# Altium project Electric Car Project.PrjPcb (part 1 of 2)
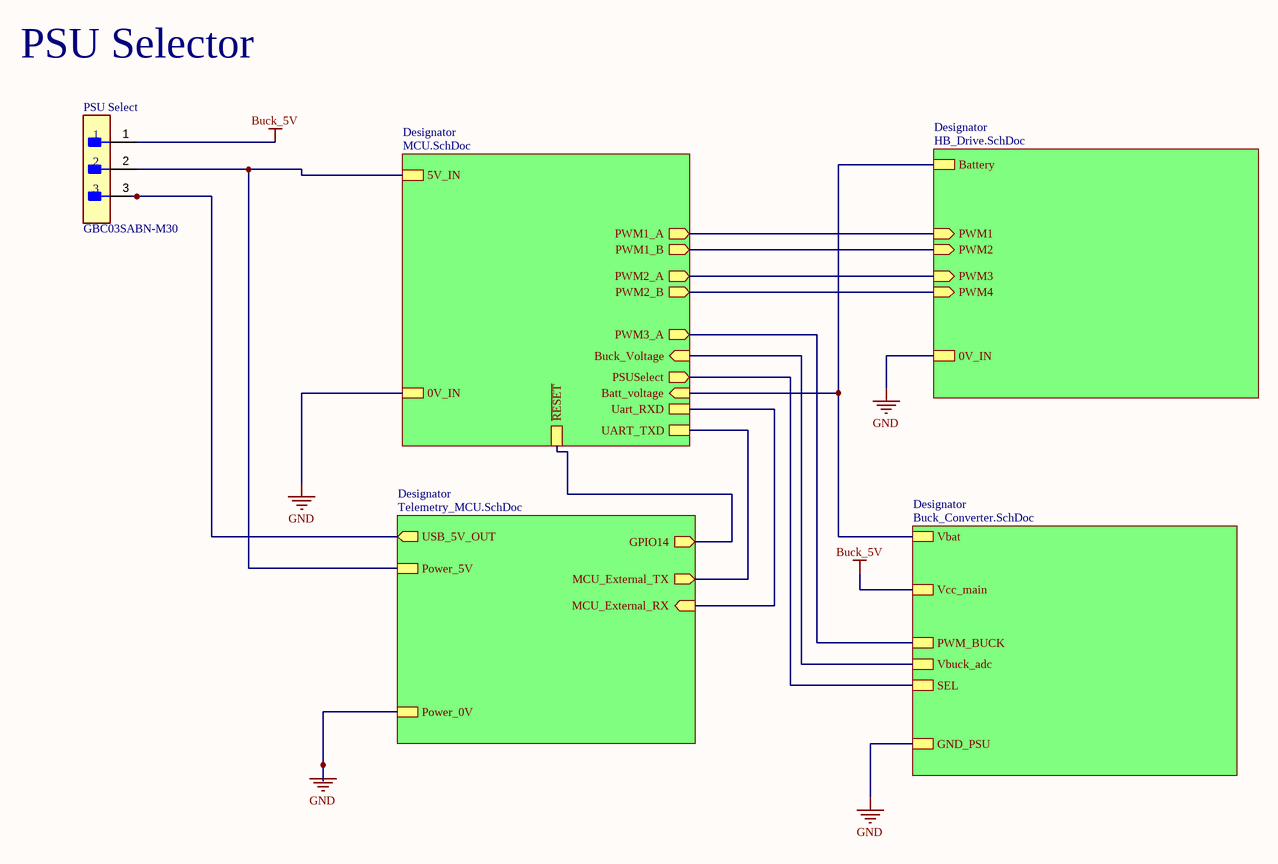
[diagram p0: Top_Level.SchDoc]
5 sheets, 126 parts. Net scope: strictly hierarchical (ports join the sheet entries above them; power ports are local).
Board file: PCB1.PcbDoc
Sheets:
  Top_Level.SchDoc
    Designator = MCU.SchDoc
    Designator = Telemetry_MCU.SchDoc
    Designator = Buck_Converter.SchDoc
    Designator = HB_Drive.SchDoc

## Sheet Top_Level.SchDoc
size 420 x 297 mm; SheetNumber: 1; SheetTotal: 5

### Parts
PSU_Select  GBC03SABN-M30  [FP-GBC03SABN-M30-MFG]

### Sub-sheets
Designator = MCU.SchDoc: PWM1_B (out), 0V_IN, PWM1_A (out), PSUSelect (out), PWM3_A (out), UART_TXD, Uart_RXD, Buck_Voltage (in), 5V_IN, PWM2_A (out), PWM2_B (out), Batt_voltage (in), ~{RESET}
Designator = Telemetry_MCU.SchDoc: Power_5V, MCU_External_TX (out), Power_0V, MCU_External_RX (in), USB_5V_OUT (out), GPIO14 (out)
Designator = Buck_Converter.SchDoc: SEL, Vbat, PWM_BUCK, Vcc_main, GND_PSU, Vbuck_adc
Designator = HB_Drive.SchDoc: PWM3 (in), PWM2 (in), PWM1 (in), PWM4 (in), 0V_IN, Battery

### Nets
+5: PSU_Select.2 ; sheet Designator/5V_IN, sheet Designator/Power_5V
+5_USB: PSU_Select.3 ; sheet Designator/USB_5V_OUT
BAT_VOLTAGE: sheet Designator/Batt_voltage, sheet Designator/Vbat, sheet Designator/Battery
Buck_5V: PSU_Select.1 ; sheet Designator/Vcc_main
GND: sheet Designator/0V_IN, sheet Designator/Power_0V, sheet Designator/GND_PSU, sheet Designator/0V_IN
BUCK_ADC: sheet Designator/Buck_Voltage, sheet Designator/Vbuck_adc
CS_PWM1B: sheet Designator/PWM1_B, sheet Designator/PWM2
MOSI_PWM_2A: sheet Designator/PWM3_A, sheet Designator/PWM_BUCK
PSU_SELECT: sheet Designator/PSUSelect, sheet Designator/SEL
PWM_1A: sheet Designator/PWM1_A, sheet Designator/PWM1
PWM_2A: sheet Designator/PWM2_A, sheet Designator/PWM3
PWM_2B: sheet Designator/PWM2_B, sheet Designator/PWM4
RESET: sheet Designator/~{RESET}, sheet Designator/GPIO14
RXD: sheet Designator/Uart_RXD, sheet Designator/MCU_External_RX
TXD: sheet Designator/UART_TXD, sheet Designator/MCU_External_TX

### Notes on the sheet
- PSU Selector
- THIS DOCUMENT AND THE DATA DISCLOSED HEREIN OR
- HEREWITH IS THE PROPERTY OF ALTIUM LIMITED AND MAY
- DWG NO:
- REVISION
- REV:
- DESCRIPTION
- DATE
- APPROVED
- BE FREELY DISTRIBUTED IN WHOLE. NO RIGHTS ARE
- RESERVED OR EXPRESS OR IMPLIED WARANTEE GIVEN.
- ENG:
- APPROVALS
- PROJECT
- DSN:
- CHK:
- REFERENCE DOCUMENTS
- PROJECT REVISION:
- TITLE
- DOCUMENT REVISION:
- DESIGN ITEM:
- BOM:
- FAB DWG:
- PCB DWG:
- ASSY DWG:
- SCALE:
- A3
- SIZE
- CAGE CODE
- FILE NAME
- DWG NO.
- SHEET
- OF
- REV

### Library data of the parts
PSU_Select = CMP-25680-000055-1: CONN HEADER SMD 3POS 2.54MM; Number of Positions: 3; Gender: Male; Connector Type: Male Pin; Pitch: 0.1inch; Contact Type: Male Pin; Contact Mating Length: 0.23inch; Termination: Solder; Housing Material: Plastic; Width: 2.54mm; Package Quantity: 1; Lead Free: Lead Free; Color: Black; Contact Plating: Gold; Housing Color: Black; Mount: Surface Mount; RoHS Compliant: Yes; Length: 7.62mm; Height: 2.54mm; Number of Contacts: 3; Contact Material: Bronze; Series: -; Number of Rows: 1; Packaging: Bulk

## Sheet MCU.SchDoc
size 420 x 297 mm; SheetNumber: 3; SheetTotal: 5
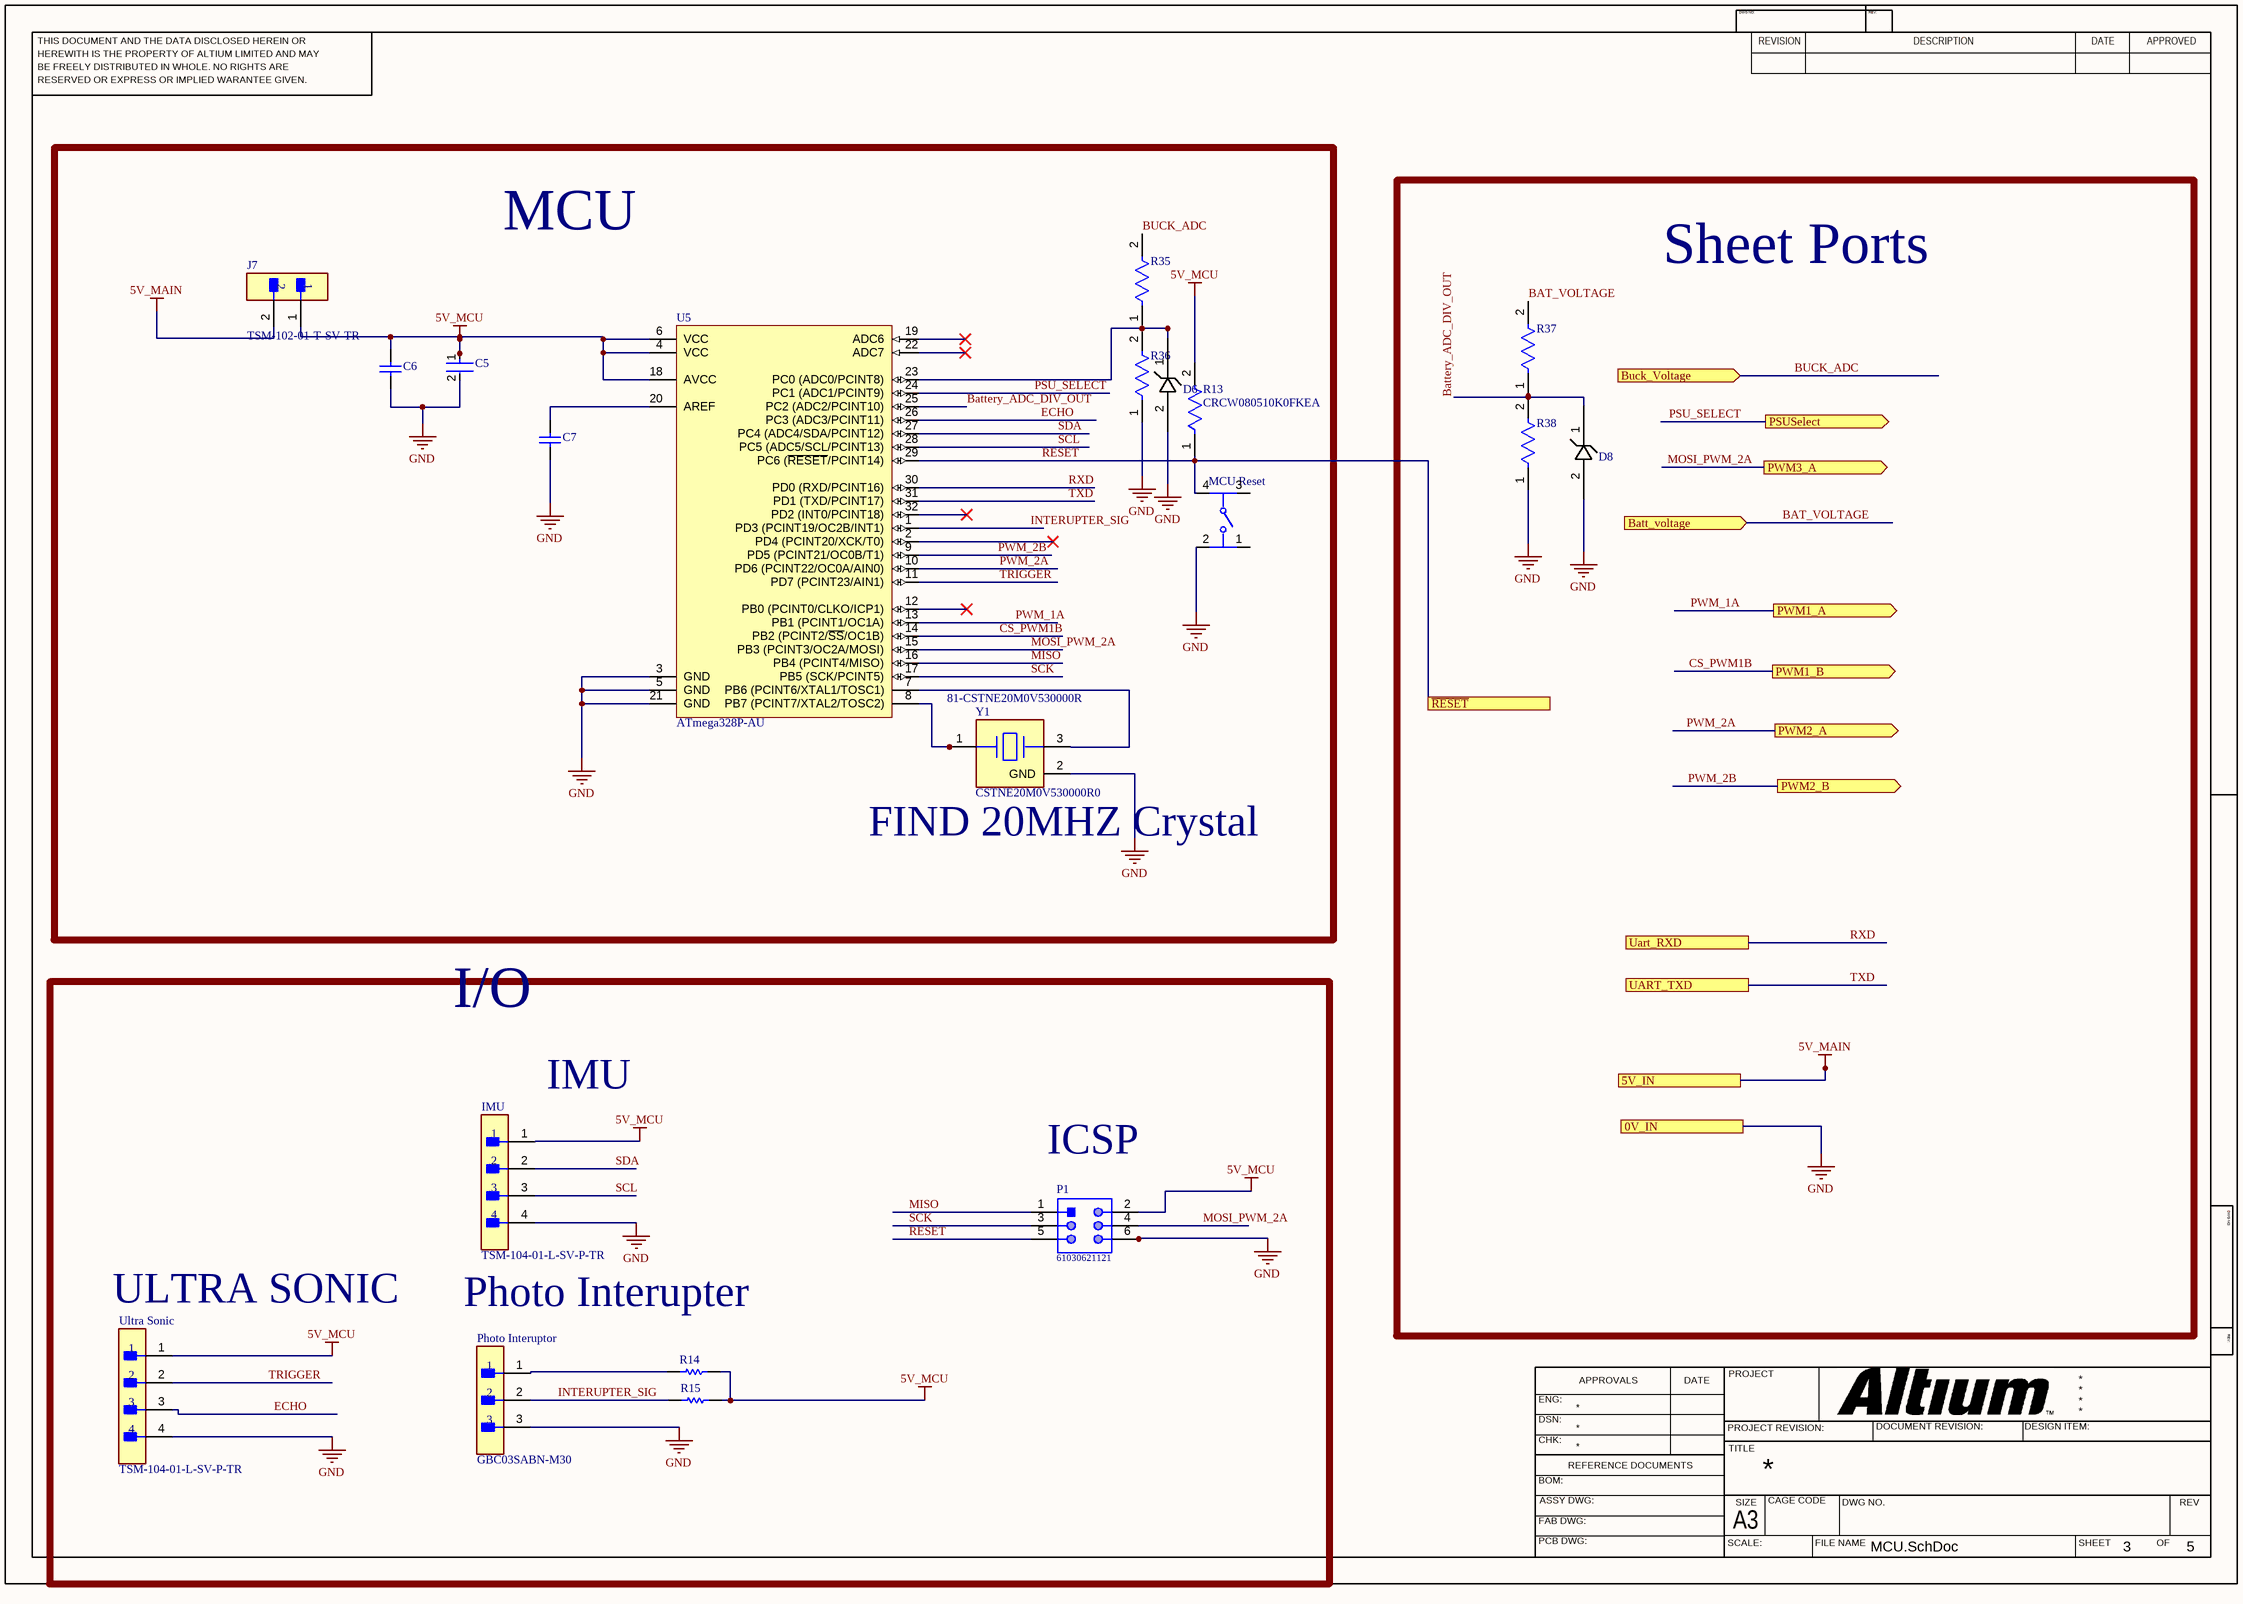
[diagram p1: MCU.SchDoc]

### Parts
C5  C0805C106K8PACTU  [FP-C0805C-DG-MFG]  (value not drawn)
C6  GRM21BR71H104KA01L  [CAPC2013X135X45ML10T25]  (value not drawn)
C7  GRM21BR71H104KA01L  [CAPC2013X135X45ML10T25]  (value not drawn)
D6  BZT52-C5V1_R1_00001  [BZT52-C5V1_R1_00001]  (value not drawn)
D8  BZT52-C5V1_R1_00001  [BZT52-C5V1_R1_00001]  (value not drawn)
IMU  TSM-104-01-L-SV-P-TR  [FP-TSM-104-01-L-SV-P-TR-MFG]
J7  TSM-102-01-T-SV-TR  [FP-TSM-102-01-T-SV-TR-MFG]
MCU_Reset  PTS645SM43SMTR92LFS  [FP-PTS645SM43SMTR92LFS-MFG]  (value not drawn)
P1  61030621121  [61030621121]
Photo_Interuptor  GBC03SABN-M30  [FP-GBC03SABN-M30-MFG]
R13  CRCW080510K0FKEA  [FP-CRCW0805-e3-MFG]
R14  ERA6AEB181V  [RESC2013X60X40LL20T25]  (value not drawn)
R15  SG73S2ATTD2201F  [RESC2013X60X30ML20T20]  (value not drawn)
R35  CRCW080510K0FKEA  [FP-CRCW0805-e3-IPC_A]  (value not drawn)
R36  CRCW080510K0FKEA  [FP-CRCW0805-e3-IPC_A]  (value not drawn)
R37  CRCW080510K0FKEA  [FP-CRCW0805-e3-IPC_A]  (value not drawn)
R38  CRCW080510K0FKEA  [FP-CRCW0805-e3-IPC_A]  (value not drawn)
U5  ATmega328P-AU  [32A_M]
Ultra_Sonic  TSM-104-01-L-SV-P-TR  [FP-TSM-104-01-L-SV-P-TR-MFG]
Y1  CSTNE20M0V530000R0  Supplier Part Number 1: 81-CSTNE20M0V530000R  [FP-CSTNE16M0V530000R0-MFG]

### Blocks framed on the sheet
MCU: C5-C7 D6 J7 MCU_Reset R13 R35 R36 U5 Y1
Sheet Ports: D8 R37 R38
I/O: IMU P1 Photo_Interuptor R14 R15 Ultra_Sonic

### Ports
0V_IN, 5V_IN, Batt_voltage (in), Buck_Voltage (in), PSUSelect (out), PWM1_A (out), PWM1_B (out), PWM2_A (out), PWM2_B (out), PWM3_A (out), Uart_RXD, UART_TXD, ~{RESET}

### Nets
5V_MAIN: J7.2 ; port 5V_IN  [project net +5]
5V_MCU: C5.1 C6.1 IMU.1 J7.1 P1.2 R13.2 R14.2 R15.2 U5.4(VCC) U5.6(VCC) U5.18(AVCC) Ultra_Sonic.1
BAT_VOLTAGE: R37.2 ; port Batt_voltage
GND: C5.2 C6.2 C7.2 D6.2 D8.2 IMU.4 MCU_Reset.2 P1.6 Photo_Interuptor.3 R36.1 R38.1 U5.3(GND) U5.5(GND) U5.21(GND) Ultra_Sonic.4 Y1.2(GND) ; port 0V_IN
Battery_ADC_DIV_OUT: D8.1 R37.1 R38.2 U5.25(PC2_(ADC2/PCINT10))
BUCK_ADC: R35.2 ; port Buck_Voltage
CS_PWM1B: U5.14(PB2_(PCINT2/~{SS}/OC1B)) ; port PWM1_B
ECHO: U5.26(PC3_(ADC3/PCINT11)) Ultra_Sonic.3
INTERUPTER_SIG: Photo_Interuptor.2 R15.1 U5.1(PD3_(PCINT19/OC2B/INT1))
MISO: P1.1 U5.16(PB4_(PCINT4/MISO))
MOSI_PWM_2A: P1.4 U5.15(PB3_(PCINT3/OC2A/MOSI)) ; port PWM3_A
PSU_SELECT: U5.24(PC1_(ADC1/PCINT9)) ; port PSUSelect
PWM_1A: U5.13(PB1_(PCINT1/OC1A)) ; port PWM1_A
PWM_2A: U5.10(PD6_(PCINT22/OC0A/AIN0)) ; port PWM2_A
PWM_2B: U5.9(PD5_(PCINT21/OC0B/T1)) ; port PWM2_B
RESET: MCU_Reset.4 P1.5 R13.1 U5.29(PC6_(~{RESET}/PCINT14)) ; port ~{RESET}
RXD: U5.30(PD0_(RXD/PCINT16)) ; port Uart_RXD
SCK: P1.3 U5.17(PB5_(SCK/PCINT5))
SCL: IMU.3 U5.28(PC5_(ADC5/SCL/PCINT13))
SDA: IMU.2 U5.27(PC4_(ADC4/SDA/PCINT12))
TRIGGER: U5.11(PD7_(PCINT23/AIN1)) Ultra_Sonic.2
TXD: U5.31(PD1_(TXD/PCINT17)) ; port UART_TXD
NetC7_1: C7.1 U5.20(AREF)
NetD6_1: D6.1 R35.1 R36.2 U5.23(PC0_(ADC0/PCINT8))
NetPhoto_Interuptor_1: Photo_Interuptor.1 R14.1
NetU5_7: U5.7(PB6_(PCINT6/XTAL1/TOSC1)) Y1.3(Output)
NetU5_8: U5.8(PB7_(PCINT7/XTAL2/TOSC2)) Y1.1(Input)

Not connected (* = marked no-connect by the designer): MCU_Reset 1 3; U5 2(PD4_(PCINT20/XCK/T0))* 12(PB0_(PCINT0/CLKO/ICP1))* 19(ADC6)* 22(ADC7)* 32(PD2_(INT0/PCINT18))*

### Notes on the sheet
- (near Y1) FIND 20MHZ Crystal
- IMU
- (near P1) ICSP
- (near Ultra_Sonic) ULTRA SONIC
- Photo Interupter
- THIS DOCUMENT AND THE DATA DISCLOSED HEREIN OR
- HEREWITH IS THE PROPERTY OF ALTIUM LIMITED AND MAY
- DWG NO:
- REVISION
- REV:
- DESCRIPTION
- DATE
- APPROVED
- BE FREELY DISTRIBUTED IN WHOLE. NO RIGHTS ARE
- RESERVED OR EXPRESS OR IMPLIED WARANTEE GIVEN.
- ENG:
- APPROVALS
- PROJECT
- DSN:
- CHK:
- REFERENCE DOCUMENTS
- PROJECT REVISION:
- TITLE
- DOCUMENT REVISION:
- DESIGN ITEM:
- BOM:
- FAB DWG:
- PCB DWG:
- ASSY DWG:
- SCALE:
- A3
- SIZE
- CAGE CODE
- FILE NAME
- DWG NO.
- SHEET
- OF
- REV

### Library data of the parts
C5 = CMP-2007-03243-2: CAP CER 10UF 10V X5R 0805; Manufacturer: Kemet; 3DS Part Number: 220-00001; Tolerance: 10%; Temperature Coefficient: 15%; Material: Ceramic; Device Class L2: Capacitors; Device Class L1: Passive Components; ComponentLink2URL: https://content.kemet.com/datasheets/KEM_C1006_X5R_SMD.pdf; Height: 1.4mm; Lead Free: Yes; Manufacturer Part Number: C0805C106K8PACTU; Digikey Description: CAP CER 10UF 10V X5R 0805; Octopart: https://octopart.com/c0805c106k8pactu-kemet-98697; Capacitance: 10uF; Value: 10uF; Temperature Range Low: -55°C; Temperature: -55°C to +85°C; Automotive: No; Mouser Description: CAP CER 10UF 10V X5R 0805; Ipc Land Pattern Name: CAPC200125X125; Temperature Range High: +85°C; Voltage: 10V; RoHS: TRUE; Device Class L3: Ceramic Capacitors; ComponentLink2Description: Datasheet; Voltage Rating: 10V; Package: C0805C-DG; Temperature Characteristic: X5R; Category: Cap
C6 C7 = CMP-2100-03644-1: Chip Capacitor, 0.1 uF, +/- 10%, 50 V, -55 to 125 degC, 0805 (2012 Metric), RoHS, Tape and Reel; Manufacturer: Murata; Voltage: 50V; Capacitance: 100nF; Insulation Resistance: 10GR; Dielectric Material: Ceramic; Dielectric: X7R; Package Description: 2-Pin Surface Mount Device, Body 2 x 1.25 mm; Manufacturer URL: http://www.murata.com/; Case Code (Imperial): 0805; Datasheet URL: http://psearch.en.murata.com/capacitor/product/GRM21BR71H104KA01%23.pdf; Termination: SMD/SMT; Lead Free: LeadFree; Package Quantity: 1; Mount: SurfaceMount; REACH SVHC: Unknown; Thickness: 0.053inch; Height: 1.25mm; Case/Package: 0805; Voltage Rating: 50V; Width: 0.049inch; Case Code (Metric): 2012; Material: Ceramic; Min Operating Temperature: -55degC; RoHSCompliant: true; Datasheet Version: 42675.0; Voltage Rating (DC): 50V; Tolerance: 10%; Package Reference: 0805; Depth: 1.25mm; Length: 2mm; Max Operating Temperature: 125degC; Packaging: TapeandReel; Number of Pins: 2; Radiation Hardening: No
D6 D8 = BZT52-C5V1_R1_00001: BZT52-C5V1_R1_00001 / 5.1V Zener Diode
IMU Ultra_Sonic = CMP-02766-000011-1: CONN HEADER SMD 4POS 2.54MM; Manufacturer: Samtec; Number Of Contacts: 4; Conn Gender: Male; Standoff Height: 0.04inch; Conn Orientation: Vertical; Current Rating: 5.4A; Voltage Rating: 475V; Manufacturer Part Number: TSM-104-01-L-SV-P-TR; Contact Material: Gold,Nickel; RoHS: TRUE; ComponentLink2URL: http://suddendocs.samtec.com/prints/tsm-1xx-xx-xxx-sv-xx-xxx-xx-mkt.pdf; Package: TSM-104-01-L-SV-P-TR; Lead Free: Yes; Automotive: No; Category: Conn; Digikey Description: CONN HEADER SMD 4POS 2.54MM; ComponentLink2Description: Datasheet; Temperature: -55°C to +125°C; Height: 0.403inch; Device Class L1: Connectors; Device Class L3: unset; Octopart: https://octopart.com/tsm-104-01-l-sv-p-tr-samtec-6805355; Pitch: 2.54mm; Footprint Url: http://suddendocs.samtec.com/prints/tsm-1xx-xx-xx-sv-xx-xxx-xx-footprint.pdf; Device Class L2: Headers and Wire Housings; Temperature Range Low: -55°C; Number Of Rows: 1; Temperature Range High: +125°C
J7 = CMP-02766-000113-1: CONN HEADER SMD 2POS 2.54MM; Gender: Male; Max Voltage Rating (AC): 475V; Number of Contacts: 2; Max Current Rating: 7A; Contact Material: Bronze; Min Operating Temperature: -55°C; REACH SVHC: No SVHC; Housing Material: Polymer; Lead Free: Lead Free; Orientation: Straight; Radiation Hardening: No; Number of Rows: 1; Length: 5.08mm; Housing Color: Black; Max Operating Temperature: 105°C; Contact Plating: Tin; Depth: 2.54mm; Packaging: Tape and Reel; Pitch: 2.54mm; Termination: Solder
MCU_Reset = CMP-2000-05160-2: SWITCH TACTILE SPST-NO 0.05A 12V; Contact Resistance: 100mR; Throw Configuration: SPST; Illumination Type: Non-Illuminated; Mechanical Life: 100000Cycles; Current Rating: 50mA; Switch Function: Off-Mom; Actuator Length: 0.85mm; Actuator Material: Nylon; Actuator Type: Standard; Operating Force: 160gf; Min Operating Temperature: -20°C; REACH SVHC: No SVHC; Termination: Gull Wing; Case/Package: SMD/SMT; Packaging: Tape and Reel; Mount: Surface Mount; Voltage Rating (DC): 12V; Orientation: Straight; Lead Free: Lead Free; Contact Material: Silver; Color: Black; Max Current Rating: 50mA; Contact Plating: Silver; Depth: 9mm; Package Quantity: 1; Max Voltage Rating (DC): 12V; Length: 6mm; Max Operating Temperature: 60°C
P1 = CMP-1502-01051-1: SMT Vertical Pin Header WR-PHD, Pitch 2.54 mm, Dual Row, 6 pins; Manufacturer: Wurth Elektronik; Gender: Male; Withstanding Voltage: 500VAC; Contact Resistance: 20mOhm; Pitch: 2.54mm; Working Voltage: 250VAC; Rated Current: 3A; Pin Number: 6; Part Number: 61030621121; Row Number: Dual; Operating Temperature: -40to125degC; Packaging: TapeandReel; Manufacturer URL: http://www.we-online.de; Package Reference: 61030621121; Publisher: WurthElektronik; Orientation: Vertical; Mounting Technology: SMT; Datasheet URL: https://katalog.we-online.de/em/datasheet/6103xx21121.pdf
Photo_Interuptor = CMP-25680-000055-1: as PSU_Select on sheet Top_Level; Contact Type: Male Pin; Contact Mating Length: 0.23inch; Termination: Solder; Housing Material: Plastic; Width: 2.54mm; Package Quantity: 1; Lead Free: Lead Free; Color: Black; Contact Plating: Gold; Housing Color: Black; Mount: Surface Mount; RoHS Compliant: Yes; Length: 7.62mm; Height: 2.54mm; Number of Contacts: 3; Contact Material: Bronze; Series: -; Number of Rows: 1; Packaging: Bulk
R13 R35-R38 = CMP-2001-04908-2: RES Thick Film, 10kΩ, 1%, 0.125W, 100ppm/°C, 0805; Resistance: 10kR; Voltage Rating (DC): 150V; Power Rating: 125mW; Weight: 0.000194oz; Package Quantity: 5000; Military Standard: Not; Max Operating Temperature: 155°C; Temperature Coefficient: 100ppm/°C; Contact Plating: Tin; Width: 1.25mm; Height: 0.45mm; Radiation Hardening: No; Tolerance: 1%; Min Operating Temperature: -55°C; Voltage Rating: 150V; Length: 2mm; Depth: 1.25mm; Termination: SMD/SMT; Packaging: Tape and Reel; Case/Package: 0805; Case Code (Metric): 2012; Lead Free: Lead Free; Case Code (Imperial): 0805; Composition: Thick Film
R14 = CMP-2001-00604-1: Manufacturer: Panasonic; Part Number: ERA6AEB181V
R15 = CMP-2001-02579-1: Manufacturer: KOA Speer; Part Number: SG73S2ATTD2201F
U5 = CMP-0095-00269-2: 8-bit AVR Microcontroller, 32KB Flash, 1KB EEPROM, 2KB SRAM, 32-pin TQFP, Industrial Grade (-40°C to 85°C); PackageDescription: 32-Lead, 7x7x1.0 mm Body, 0.8mm Lead Pitch, Thin Profile Plastic Quad Flat Package (TQFP); DatasheetVersion: revD, May-2011; RevisionNote: DatasheetVersion & PackageVersion updated. URLs added.; ComponentLink1URL: http://www.atmel.com/; ComponentLink2Description: ATmega48A/48PA/88A/88PA/168A/168PA/328/328P Datasheet; Code_JEDEC: MS-026-ABA; ComponentLink1Description: Manufacturer URL; PackageReference: 32A; ComponentLink3Description: ATmega48A/48PA/88A/88PA/168A/168PA/328/328P Summary; ComponentLink2URL: http://www.atmel.com/dyn/resources/prod_documents/doc8271.pdf; PackageVersion: revC, Oct-2010; ComponentLink3URL: http://www.atmel.com/dyn/resources/prod_documents/8271S.pdf
Y1 = CMP-06054-000001-1: CERAMIC RES 20.0000MHZ 15PF SMD; Manufacturer Part Number: CSTNE16M0V530000R0; Manufacturer: Murata; Tolerance: 0.5%; Stability: 0.3%; Frequency: 16MHz; Esr: 40Ω; Isolated Power: No; Number of Channels: 6; Channel Type: Unidirectional; Data Rate: 150Mbps; Propagation Delay: 13ns; Pulse Width Distortion (PWD): 4.5ns; Impedance: 40R; Lead Free: Yes; ComponentLink2URL: https://www.murata.com/en-sg/products/productdata/8801162231838/SPEC-CSTNE16M0V530000R0.pdf?1545967809000; ComponentLink2Description: Datasheet; Device Class L3: Crystals; Load Capacitance: 15pF; Temperature: -40°C to +85°C; Temperature Range High: +85°C; Series: CSTNE_V; Mouser Description: Ceramic Resonator 16MHz ±0.5% (Tol) ±0.3% (Stability) 15pF 40Ohm 3-Pin CSMD T/R; Automotive: No; RoHS: TRUE; Device Class L2: Crystals / Oscillators; Package: 0; Category: Crys; Device Class L1: Passive Components; Height: 1mm; Temperature Range Low: -40°C; Digikey Description: CERAMIC RES 16.0000MHZ 15PF SMD; Octopart: https://octopart.com/cstne16m0v530000r0-murata-91406924; Supplier 1: Mouser; Stock 1: 22987; Pricing 1: 1=0.27000, 10=0.22300, 50=0.20100, 100=0.17800, 1000=0.14300, 10000=0.13400 (USD); Mount: Surface Mount; Case/Package: SSOP; Min Operating Temperature: -40°C; Max Operating Temperature: 85°C; Type: General Purpose; Resistor Type: Ceramic; Packaging: Rail/Tube; Frequency Stability: 0.3%; Frequency Tolerance: 0.5%; Capacitance: 15pF; RoHS Compliant: Yes; ComponentLink1URL: https://www.murata.com/en/products/productdata/8801161510942/SPEC-CSTNE20M0V530000R0.pdf?src-supplier=Digi-Key; ComponentLink1Description: https://www.murata.com/en/products/productdata/8801161510942/SPEC-CSTNE20M0V530000R0.pdf?src-supplier=Digi-Key

## Sheet Telemetry_MCU.SchDoc
size 420 x 297 mm; SheetNumber: 4; SheetTotal: 5
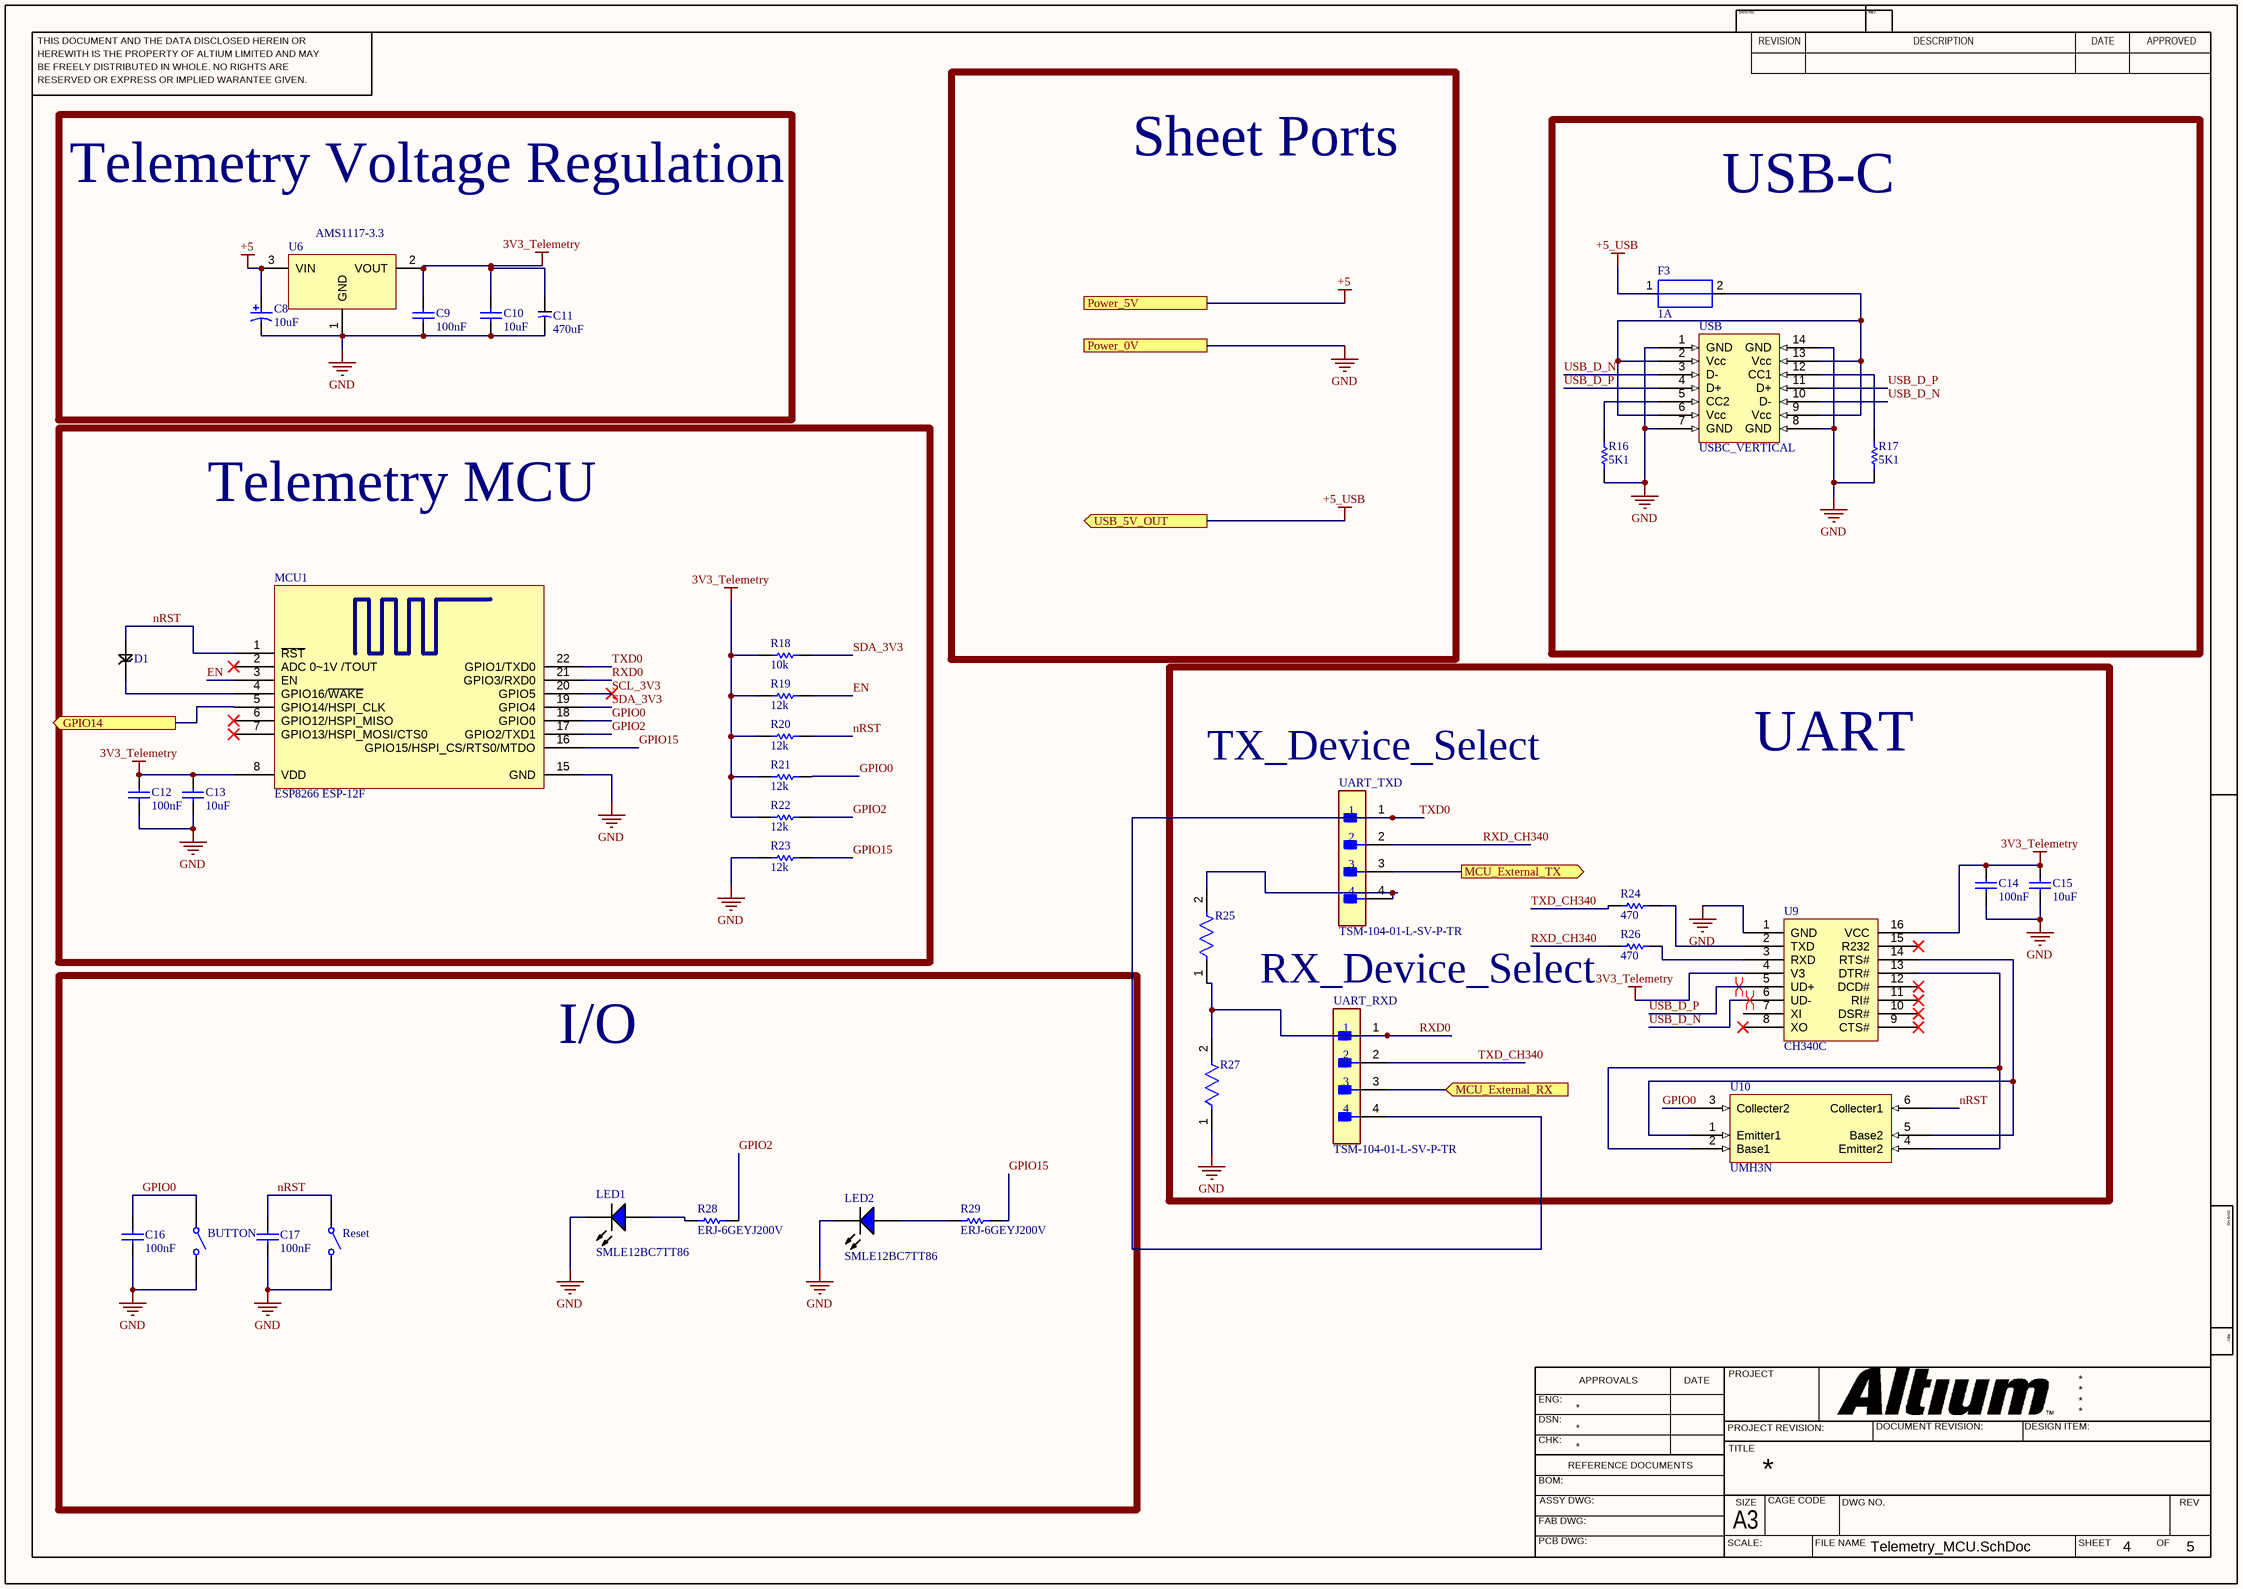
[diagram p2: Telemetry_MCU.SchDoc]

### Parts
BUTTON  434111050826  [434111050826]  (value not drawn)
C8  10uF  [KEMT-A-3216-18-2_M]
C9  100nF  [CAPC2013X88X50NL20T25]
C10  10uF  [CAPC2013X140X50NL20T25]
C11  470uF  [ULR477M1AE85RR]
C12  100nF  [CAPC2013X88X50NL20T25]
C13  10uF  [CAPC2013X140X50NL20T25]
C14  100nF  [CAPC2013X88X50NL20T25]
C15  10uF  [CAPC2013X140X50NL20T25]
C16  100nF  [CAPC2013X88X50NL20T25]
C17  100nF  [CAPC2013X88X50NL20T25]
D1  DFLS230L-7  [DFLS230L-7]  (value not drawn)
F3  1A  [0ZCG0050AF2C]
LED1  SMLE12BC7TT86  [ROHM-SMLE12BC7TT86_V]
LED2  SMLE12BC7TT86  [ROHM-SMLE12BC7TT86_V]
MCU1  ESP8266 ESP-12F  [ESP8266 ESP_12F - Danon NoSPI]
R16  5K1  [RESC2013X50X30NL20T20]
R17  5K1  [RESC2013X50X30NL20T20]
R18  10k  [RESC2013X60X40NL20T25_A]
R19  12k  [RESC2013X60X40NL20T25_A]
R20  12k  [RESC2013X60X40NL20T25_A]
R21  12k  [RESC2013X60X40NL20T25_A]
R22  12k  [RESC2013X60X40NL20T25_A]
R23  12k  [RESC2013X60X40NL20T25_A]
R24  470  [RESC2013X50X30NL20T20]
R25  CRCW080510K0FKEA  [FP-CRCW0805-e3-IPC_A]  (value not drawn)
R26  470  [RESC2013X50X30NL20T20]
R27  CRCW080510K0FKEA  [FP-CRCW0805-e3-IPC_A]  (value not drawn)
R28  ERJ-6GEYJ200V  [RESC2013X70X40LL20T20]
R29  ERJ-6GEYJ200V  [RESC2013X70X40LL20T20]
Reset  434111050826  [434111050826]  (value not drawn)
U6  AMS1117-3.3  [SOT-223]
U9  CH340C  [SOP16_50Mil_PinPitch]
U10  UMH3N  [UMH3N]
UART_RXD  TSM-104-01-L-SV-P-TR  [FP-TSM-104-01-L-SV-P-TR-MFG]
UART_TXD  TSM-104-01-L-SV-P-TR  [FP-TSM-104-01-L-SV-P-TR-MFG]
USB  USBC_VERTICAL  [USBC_Vertical]

### Blocks framed on the sheet
Telemetry Voltage Regulation: C8-C11 U6
USB-C: F3 R16 R17 USB
Telemetry MCU: C12 C13 D1 MCU1 R18-R23
UART: C14 C15 R24-R27 U9 U10 UART_RXD UART_TXD
I/O: BUTTON C16 C17 LED1 LED2 R28 R29 Reset

### Ports
GPIO14 (out), MCU_External_RX (in), MCU_External_TX (out), Power_0V, Power_5V, USB_5V_OUT (out)

### Nets
3V3_Telemetry: C9.2 C10.2 C11.2 C12.2 C13.2 C14.2 C15.2 MCU1.8(VDD) R18.1 R19.1 R20.1 R21.1 R22.1 U6.2(VOUT) U9.4(V3) U9.16(VCC)
+5: C8.1 U6.3(VIN) ; port Power_5V
+5_USB: F3.1(+) ; port USB_5V_OUT
GND: BUTTON.2 C8.2 C9.1 C10.1 C11.1 C12.1 C13.1 C14.1 C15.1 C16.1 C17.1 LED1.2(K) LED2.2(K) MCU1.15(GND) R16.1 R17.1 R23.1 R27.1 Reset.2 U6.1(GND) U9.1(GND) USB.1(GND) USB.7(GND) USB.8(GND) USB.14(GND) ; port Power_0V
EN: MCU1.3(EN) R19.2
GPIO0: BUTTON.1 C16.2 MCU1.18(GPIO0) R21.2 U10.3(Collecter2)
GPIO2: MCU1.17(GPIO2/TXD1) R22.2 R28.2
GPIO15: MCU1.16(GPIO15/HSPI_CS/RTS0/MTDO) R23.2 R29.2
nRST: C17.2 D1.1 MCU1.1(~{RST}) R20.2 Reset.1 U10.6(Collecter1)
RESET: MCU1.5(GPIO14/HSPI_CLK) ; port GPIO14
RXD: UART_RXD.3 ; port MCU_External_RX
RXD0: MCU1.21(GPIO3/RXD0) R25.1 R27.2 UART_RXD.1
RXD_CH340: R26.1 UART_TXD.2
SCL_3V3: MCU1.20(GPIO5)
SDA_3V3: MCU1.19(GPIO4) R18.2
TXD: UART_TXD.3 ; port MCU_External_TX
TXD0: MCU1.22(GPIO1/TXD0) UART_RXD.4 UART_TXD.1
TXD_CH340: R24.1 UART_RXD.2
USB_D_N: U9.6(UD-) USB.3(D-) USB.10(D-)
USB_D_P: U9.5(UD+) USB.4(D+) USB.11(D+)
NetD1_2: D1.2 MCU1.4(GPIO16/~{WAKE})
NetF3_2: F3.2(-) USB.2(Vcc) USB.6(Vcc) USB.9(Vcc) USB.13(Vcc)
NetLED1_1: LED1.1(A) R28.1
NetLED2_1: LED2.1(A) R29.1
NetR16_2: R16.2 USB.5(CC2)
NetR17_2: R17.2 USB.12(CC1)
NetR24_2: R24.2 U9.2(TXD)
NetR25_2: R25.2 UART_TXD.4
NetR26_2: R26.2 U9.3(RXD)
NetU9_13: U9.13(DTR#) U10.2(Base1) U10.4(Emitter2)
NetU9_14: U9.14(RTS#) U10.1(Emitter1) U10.5(Base2)

Not connected (* = marked no-connect by the designer): MCU1 2(ADC_0~1V_/TOUT)* 6(GPIO12/HSPI_MISO)* 7(GPIO13/HSPI_MOSI/CTS0)*; U9 7(XI) 8(XO)* 9(CTS#)* 10(DSR#)* 11(RI#)* 12(DCD#)* 15(R232)*

### Layout directives
differential pair: USB_D_N, USB_D_P

### Notes on the sheet
- Sheet Ports
- (near UART_TXD) TX_Device_Select
- (near R26) RX_Device_Select
- THIS DOCUMENT AND THE DATA DISCLOSED HEREIN OR
- HEREWITH IS THE PROPERTY OF ALTIUM LIMITED AND MAY
- DWG NO:
- REVISION
- REV:
- DESCRIPTION
- DATE
- APPROVED
- BE FREELY DISTRIBUTED IN WHOLE. NO RIGHTS ARE
- RESERVED OR EXPRESS OR IMPLIED WARANTEE GIVEN.
- ENG:
- APPROVALS
- PROJECT
- DSN:
- CHK:
- REFERENCE DOCUMENTS
- PROJECT REVISION:
- TITLE
- DOCUMENT REVISION:
- DESIGN ITEM:
- BOM:
- FAB DWG:
- PCB DWG:
- ASSY DWG:
- SCALE:
- A3
- SIZE
- CAGE CODE
- FILE NAME
- DWG NO.
- SHEET
- OF
- REV

### Library data of the parts
BUTTON Reset = CMP-1459-00003-1: WS-TASV SMD Tact Switch 6.0X3.5 mm; Manufacturer: Wuerth Elektronik; NoPins: 02; ComponentLink2URL: http://katalog.we-online.de/em/datasheet/434111050826.pdf; PackageReference: 434111050826; ComponentLink2Description: Datasheet; PartNumber: 434111050826; ComponentLink1URL: http://www.we-online.com; ComponentLink1Description: Manufacturer URL
C8 = CMP-2000-05172-1: Capacitor, Tantalum, 10 uF, +/- 10%, 10 V, -55 to 125 degC, 2-Pin SMD (1206), RoHS, Tape and Reel; Manufacturer Size Code: A; Manufacturer: Kemet; Type: Molded; Online Catalog: T491Series; Other Names: 399-3684-2; Voltage - Rated: 10V; Lifetime @ Temp.: 2000Hrs@85degC; Product Training Modules: CapacitorBasics-TypicalUsesforCapacitorsDeratingGuidelinesforSurfaceMountTantalumCapacitors; ESR (Equivalent Series Resistance): 3.8Ohm; Capacitance: 10µF; Catalog Drawings: T49x,T5xxSeries_A-side1T49x,T5xxSeries_A,B-side2T49x,T5xxSeries_A,SBottom; Family: TantalumCapacitors; Manufacturer URL: http://www.kemet.com/; Datasheet URL: http://www.farnell.com/datasheets/1824869.pdf; Package Reference: 1206; Packaging: Tape&Reel(TR); Series: T491; Operating Temperature: -55degC~125degC; Mounting Type: SurfaceMount; Height - Seated (Max): 0.071"(1.80mm); Package / Case: 1206(3216Metric); Package Description: 2-Pin Surface Mount Device, Body 3.2 x 1.6 mm; Features: GeneralPurpose; Tolerance: ±10%; Lead Spacing: -; Size / Dimension: 0.126"Lx0.063"W(3.20mmx1.60mm); Standard Package: 2,000; Datasheet Version: Apr-14; Category: Capacitors
C9 C12 C14 C16 C17 = CMP-2007-00279-1: Part Number: C0805C104K5RACTU; Manufacturer: Kemet
C10 C13 C15 = CMP-2007-03243-1: Part Number: C0805C106K8PACTU; Manufacturer: Kemet
C11 = ULR477M1AE85RR
F3 = 0ZCG0050AF2C: PTC Resettable Fuse 0.5A(hold) 1A(trip) 30VDC 100A 0.8W 0.15s 0.15Ohm SMD Solder Pad 1812 T/R; Manufacturer: Bel; Hold Current: 500mA; Supplier 1: Newark; Manufacturer Part Number: 0ZCG0050AF2C; RoHS: Yes; Category: PTC Resettable Fuses; Stock 1: 19101; Pricing 1: 1=0.14000, 10=0.12900, 25=0.12200, 50=0.11500, 100=0.10700, 250=0.09600 (USD); Mount: Surface Mount; Case/Package: 1812; Case Code (Metric): 4532; Case Code (Imperial): 1812; Contact Plating: Tin,Matte; Min Operating Temperature: -40°C; Max Operating Temperature: 85°C; Package Quantity: 1; Packaging: Tape and Reel; Max Current Rating: 100A; Trip Current: 1A; Time to Trip: 0.15s; Lead Free: Lead Free; RoHS Compliant: Yes; ComponentLink1URL: https://datasheet.ciiva.com/18550/0zcg-18550748.pdf?src-supplier=Digi-Key; ComponentLink1Description: https://datasheet.ciiva.com/18550/0zcg-18550748.pdf?src-supplier=Digi-Key; ComponentLink2URL: https://datasheet.ciiva.com/18550/0zcg-18550749.pdf?src-supplier=Digi-Key; ComponentLink2Description: https://datasheet.ciiva.com/18550/0zcg-18550749.pdf?src-supplier=Digi-Key; ComponentLink3URL: https://datasheet.ciiva.com/18550/0zcg-18550750.pdf?src-supplier=Digi-Key; ComponentLink3Description: https://datasheet.ciiva.com/18550/0zcg-18550750.pdf?src-supplier=Digi-Key; Supplier Part Number 1: 48AC8390
LED1 LED2 = CMP-2000-07118-1: Blue LED, 2.9 V, 20 mA, -30 to 85 degC, 2-Pin SMD, RoHS, Tape and Reel; Manufacturer: Rohm; Lens Type: Clear; Viewing Angle: 140°; Forward Voltage: 2.9V; Forward (Drive) Current: 20mA; Intensity: 22mcd; Datasheet Version: Rev. 2.0, 03/2010; Package Description: 2-Pin Surface Mount Device, Body 1.6 x 0.8 mm; Mounting Technology: SurfaceMount; Dimension: 1.6x0.8x0.36mm; Package Reference: 1608; Datasheet URL: https://datasheet.ciiva.com/11773/0900766b80df3ad8-11773825.pdf; Color: Blue; Manufacturer URL: http://www.rohm.com/web/global/
MCU1 = ESP8266 ESP-12F - Danon - NoSPI
R16 R17 = CMP-2001-04024-1: Manufacturer: Vishay Dale; Part Number: CRCW08055K10FKEA
R18-R23 = CMP-2000-06228-1: Metal Film Chip Resistor, High Reliability Type, 0.125 W, +/- 0.1%, -55 to 155 degC, 0805 (2012 Metric), RoHS, Tape and Reel; Voltage Rating: 100V; Power Rating: 125mW(1/8W); Brand: Panasonic; Temperature Coefficient: 25PPM/C; Resistance: 10kOhms; Product Category: ThinFilmResistors-SMD; Datasheet Version: 02/2016; Operating Temperature Range: -55Cto+155C; Length: 2mm; Mounting Technology: SurfaceMount; Manufacturer URL: http://www.panasonic.com/; Width: 1.25mm; Packaging: Reel; Product: ThinFilmResistorsSMD; Package / Case: 0805(2012metric); Termination Style: SMD/SMT; Tolerance: 0.1%; Datasheet URL: https://industrial.panasonic.com/cdbs/www-data/pdf/RDM0000/AOA0000C307.pdf; Package Description: 2-Pin Surface Mount Device, Body 2 x 1.25 mm; Factory Pack Quantity: 5000; Series: ERA-6A; Case Code - mm: 2012; RoHS: Details; Package Reference: 0805; Height: 0.5mm; Manufacturer: Panasonic; Case Code - in: 0805; Type: MetalFilmChipResistors
R24 R26 = CMP-2001-03930-1: Manufacturer: Vishay Dale; Part Number: CRCW0805470KFKEA
R25 R27 = CMP-2001-04908-2: as R13 on sheet MCU; Weight: 0.000194oz; Package Quantity: 5000; Military Standard: Not; Max Operating Temperature: 155°C; Temperature Coefficient: 100ppm/°C; Contact Plating: Tin; Width: 1.25mm; Height: 0.45mm; Radiation Hardening: No; Tolerance: 1%; Min Operating Temperature: -55°C; Voltage Rating: 150V; Length: 2mm; Depth: 1.25mm; Termination: SMD/SMT; Packaging: Tape and Reel; Case/Package: 0805; Case Code (Metric): 2012; Lead Free: Lead Free; Case Code (Imperial): 0805; Composition: Thick Film
R28 R29 = CMP-2001-00368-1: Manufacturer: Panasonic; Part Number: ERJ-6GEYJ200V
U6 = AMS1117-3.3: 3.3V  3-Terminal Adjustable Positive Voltage Regulator; ComponentLink1Description: Supplier URL; ComponentLink1URL: https://lcsc.com/product-detail/Low-Dropout-Regulators-LDO_AMS_AMS1117-3-3_AMS1117-3-3_C6186.html
UART_RXD UART_TXD = CMP-02766-000011-1: as IMU on sheet MCU; Manufacturer Part Number: TSM-104-01-L-SV-P-TR; Contact Material: Gold,Nickel; RoHS: TRUE; ComponentLink2URL: http://suddendocs.samtec.com/prints/tsm-1xx-xx-xxx-sv-xx-xxx-xx-mkt.pdf; Package: TSM-104-01-L-SV-P-TR; Lead Free: Yes; Automotive: No; Category: Conn; Digikey Description: CONN HEADER SMD 4POS 2.54MM; ComponentLink2Description: Datasheet; Temperature: -55°C to +125°C; Height: 0.403inch; Device Class L1: Connectors; Device Class L3: unset; Octopart: https://octopart.com/tsm-104-01-l-sv-p-tr-samtec-6805355; Pitch: 2.54mm; Footprint Url: http://suddendocs.samtec.com/prints/tsm-1xx-xx-xx-sv-xx-xxx-xx-footprint.pdf; Device Class L2: Headers and Wire Housings; Temperature Range Low: -55°C; Number Of Rows: 1; Temperature Range High: +125°C
U9 = CH340C: ComponentLink1Description: Supplier URL; ComponentLink1URL: https://lcsc.com/product-detail/USB_CH340C_C84681.html

## Sheet Buck_Converter.SchDoc
size A; SheetNumber: 5; SheetTotal: 5
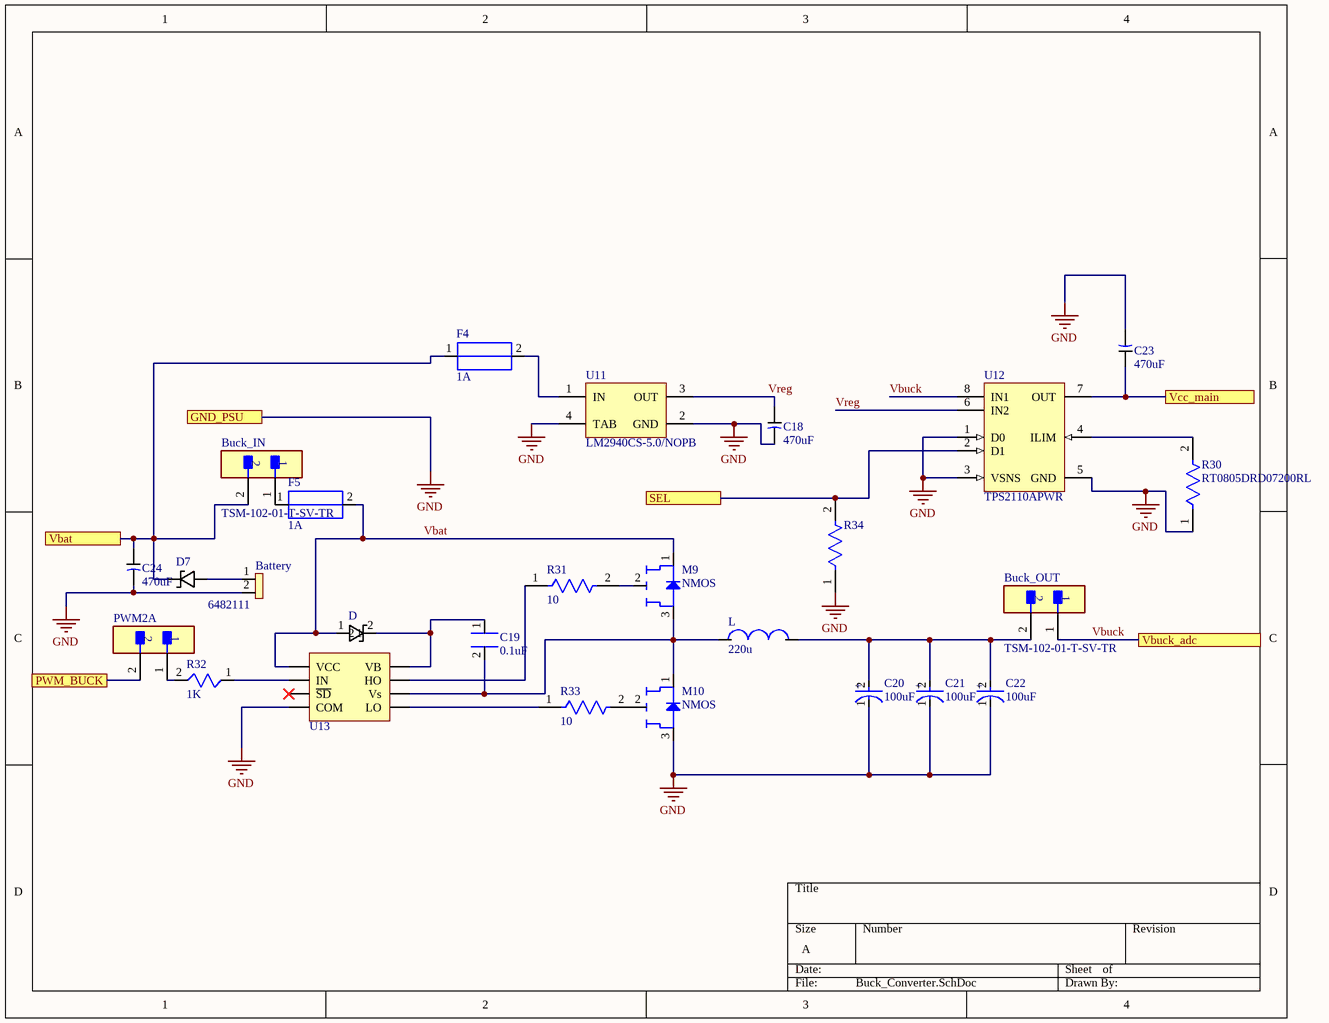
[diagram p3: Buck_Converter.SchDoc]

### Parts
Battery  Supplier Part Number 1: 6482111  [ERM BLOCK 2POS 45DEG 2.5MM PCB]  (hidden comment: Screw Terminal)
Buck_IN  TSM-102-01-T-SV-TR  [FP-TSM-102-01-T-SV-TR-MFG]
Buck_OUT  TSM-102-01-T-SV-TR  [FP-TSM-102-01-T-SV-TR-MFG]
C18  470uF  [ULR477M1AE85RR]
C19  0.1uF  [0805B104K500BD]
C20  100uF  [FP-TAJD-MFG]
C21  100uF  [FP-TAJD-MFG]
C22  100uF  [FP-TAJD-MFG]
C23  470uF  [ULR477M1AE85RR]
C24  470uF  [ULR477M1AE85RR]
D  BAS3005B02VH6327XTSA1  [BAS3005B02VH6327XTSA1]  (value not drawn)
D7  STPS2L25  [STPS2L25]  (value not drawn)
F4  1A  [0ZCG0050AF2C]
F5  1A  [0ZCG0050AF2C]
L  220u  [SRR1280-221K]
M9  NMOS  [AOD424]
M10  NMOS  [AOD424]
PWM2A  TSM-102-01-T-SV-TR  [FP-TSM-102-01-T-SV-TR-MFG]  (value not drawn)
R30  RT0805DRD07200RL  [FP-RT0805-MFG]
R31  10  [FP-RNCP1206-IPC_C]
R32  1K  [RNCP0805FTD10R0]
R33  10  [FP-RNCP1206-IPC_C]
R34  CRCW080510K0FKEA  [FP-CRCW0805-e3-IPC_A]  (value not drawn)
U11  LM2940CS-5.0/NOPB  [KTT0003B_N]
U12  TPS2110APWR  [PW0008A_N]
U13  IR2302  [IR2302S]  (value not drawn)

### Ports
GND_PSU, PWM_BUCK, SEL, Vbat, Vbuck_adc, Vcc_main

### Nets
BAT_VOLTAGE: Buck_IN.2 C24.2 D7.1 F4.1(+) ; port Vbat
Buck_5V: C23.2 U12.7(OUT) ; port Vcc_main
GND: Battery.2 C18.1 C20.1(C) C21.1(C) C22.1(C) C23.1 C24.1 M10.3(S) R30.1 R34.1 U11.2(GND) U11.4(TAB) U12.1(D0) U12.3(VSNS) U12.5(GND) U13.4(COM) ; port GND_PSU
MOSI_PWM_2A: PWM2A.2 ; port PWM_BUCK
PSU_SELECT: R34.2 U12.2(D1) ; port SEL
Vbat: D.1 F5.2(-) M9.1(D) U13.1(VCC)
Vbuck: Buck_OUT.1 U12.8(IN1) ; port Vbuck_adc  [project net BUCK_ADC]
Vreg: C18.2 U11.3(OUT) U12.6(IN2)
NetBattery_1: Battery.1 D7.2
NetBuck_IN_1: Buck_IN.1 F5.1(+)
NetBuck_OUT_2: Buck_OUT.2 C20.2(A) C21.2(A) C22.2(A) L.2
NetC19_1: C19.1(+) D.2 U13.8(VB)
NetC19_2: C19.2 L.1 M9.3(S) M10.1(D) U13.6(Vs)
NetF4_2: F4.2(-) U11.1(IN)
NetM9_2: M9.2(G) R31.2
NetM10_2: M10.2(G) R33.2
NetPWM2A_1: PWM2A.1 R32.2(-)
NetR30_2: R30.2 U12.4(ILIM)
NetR31_1: R31.1 U13.7(HO)
NetR32_1: R32.1(+) U13.2(IN)
NetR33_1: R33.1 U13.5(LO)

Not connected (* = marked no-connect by the designer): U13 3(~{SD})*

### Notes on the sheet
- (in symbol CMP-2000-05064-2) +

### Library data of the parts
Battery = ERM BLOCK 2POS 45DEG 2.5MM PCB: Supplier 1: RSComponents
Buck_IN Buck_OUT PWM2A = CMP-02766-000113-1: as J7 on sheet MCU; Contact Material: Bronze; Min Operating Temperature: -55°C; REACH SVHC: No SVHC; Housing Material: Polymer; Lead Free: Lead Free; Orientation: Straight; Radiation Hardening: No; Number of Rows: 1; Length: 5.08mm; Housing Color: Black; Max Operating Temperature: 105°C; Contact Plating: Tin; Depth: 2.54mm; Packaging: Tape and Reel; Pitch: 2.54mm; Termination: Solder
C18 C23 C24 = ULR477M1AE85RR
C19 = 0805B104K500BD: 0.1 uF 50V Cap
C20-C22 = CMP-2000-05064-2: 100uF 16V  ±10% 600mΩ 2917  SMD Tantalum CapacitorTAJD107K016RNJ; Dissipation Factor: 6%; Polarity: Polar; Leakage Current: 16uA; ESR (Equivalent Series Resistance): 600mR; Depth: 4.3mm; Series: TAJ; Case Code (Metric): 7343; Min Operating Temperature: -55°C; Packaging: Tape and Reel; Termination: SMD/SMT; Voltage Rating (DC): 16V; Case/Package: 2917; Number of Pins: 2; Width: 4.3mm; Mount: Surface Mount; Tolerance: 10%; Voltage: 16V; Radiation Hardening: No; Lead Free: Lead Free; Capacitance: 100uF; Height: 2.9mm; RoHS Compliant: Yes; Max Operating Temperature: 125°C; Construction: Flat; Height - Seated (Max): 0.122inch; Case Code (Imperial): 2917; Package Quantity: 1; Dielectric Material: Tantalum; REACH SVHC: No SVHC; Features: General Purpose; Voltage Rating: 16V; Length: 7.3mm
D = BAS3005B02VH6327XTSA1: 30V, Vf 620 mV @ 500 mA, 25 µA @ 30 V, Fast Recovery =< 500ns, > 200mA
F4 F5 = 0ZCG0050AF2C: as F3 on sheet Telemetry_MCU; Supplier 1: Newark; Manufacturer Part Number: 0ZCG0050AF2C; RoHS: Yes; Category: PTC Resettable Fuses; Stock 1: 19101; Pricing 1: 1=0.14000, 10=0.12900, 25=0.12200, 50=0.11500, 100=0.10700, 250=0.09600 (USD); Mount: Surface Mount; Case/Package: 1812; Case Code (Metric): 4532; Case Code (Imperial): 1812; Contact Plating: Tin,Matte; Min Operating Temperature: -40°C; Max Operating Temperature: 85°C; Package Quantity: 1; Packaging: Tape and Reel; Max Current Rating: 100A; Trip Current: 1A; Time to Trip: 0.15s; Lead Free: Lead Free; RoHS Compliant: Yes; ComponentLink1URL: https://datasheet.ciiva.com/18550/0zcg-18550748.pdf?src-supplier=Digi-Key; ComponentLink1Description: https://datasheet.ciiva.com/18550/0zcg-18550748.pdf?src-supplier=Digi-Key; ComponentLink2URL: https://datasheet.ciiva.com/18550/0zcg-18550749.pdf?src-supplier=Digi-Key; ComponentLink2Description: https://datasheet.ciiva.com/18550/0zcg-18550749.pdf?src-supplier=Digi-Key; ComponentLink3URL: https://datasheet.ciiva.com/18550/0zcg-18550750.pdf?src-supplier=Digi-Key; ComponentLink3Description: https://datasheet.ciiva.com/18550/0zcg-18550750.pdf?src-supplier=Digi-Key; Supplier Part Number 1: 48AC8390
L = SRR1280-221K
M9 M10 = AOD424: MOSFET N-CH 20V 18A TO252; Manufacturer: Alpha & Omega Semiconductor; Rds On Max: 4.4mR; Input Capacitance: 4.63nF; Continuous Drain Current (ID): 45A; Max Power Dissipation: 2.5W; Number of Outputs: 2; Rise Time: 220ns; Output Current: 200mA; Min Supply Voltage: 5V; Nominal Supply Current: 1.6mA; Output Voltage: 620V; Propagation Delay: 950ns; Max Output Current: 350mA; Fall Time: 80ns; Turn-Off Delay Time: 70ns; Power Dissipation: 625mW; Min Output Voltage: 10V; Supplier 1: Digi-Key; Manufacturer Part Number: AOD424; RoHS: Yes; Category: Transistors; Stock 1: 1803; Pricing 1: 1=0.98000, 10=0.86400, 100=0.66240, 500=0.52360, 1000=0.41888 (USD); Mount: Surface Mount; Case/Package: TO-252-3; Min Operating Temperature: -55°C; Max Operating Temperature: 175°C; Packaging: Tape and Reel; Drain to Source Voltage (Vdss): 20V; Series: -; RoHS Compliant: Yes; ComponentLink1URL: https://datasheet.ciiva.com/6384/aod424-6384722.pdf?src-supplier=Digi-Key; ComponentLink1Description: https://datasheet.ciiva.com/6384/aod424-6384722.pdf?src-supplier=Digi-Key; ComponentLink2URL: https://datasheet.ciiva.com/6384/aod424-6384725.pdf?src-supplier=Digi-Key; ComponentLink2Description: https://datasheet.ciiva.com/6384/aod424-6384725.pdf?src-supplier=Digi-Key; Supplier 2: Newark; Number of Pins: 8; Package Quantity: 950; Max Supply Voltage: 20V; Number of Drivers: 2; Turn-On Delay Time: 70ns; Max Supply Current: 1.6mA; Max Output Voltage: 20V; Termination: SMD/SMT; Length: 5mm; Width: 4mm; Height: 1.5mm; Radiation Hardening: No; Lead Free: Lead Free; REACH SVHC: No SVHC; ComponentLink3URL: https://datasheet.ciiva.com/1952/ir2302-1952914.pdf?src-supplier=Digi-Key; ComponentLink3Description: https://datasheet.ciiva.com/1952/ir2302-1952914.pdf?src-supplier=Digi-Key; ComponentLink4URL: https://datasheet.ciiva.com/15110/getdatasheetpartid-188955-15110020.pdf?src-supplier=Verical; ComponentLink4Description: https://datasheet.ciiva.com/15110/getdatasheetpartid-188955-15110020.pdf?src-supplier=Verical; ComponentLink5URL: https://datasheet.ciiva.com/1499/60025-1499718.pdf?src-supplier=Element14; ComponentLink5Description: https://datasheet.ciiva.com/1499/60025-1499718.pdf?src-supplier=Element14; Supplier Part Number 1: 785-1565-1-ND
R30 = CMP-03412-013530-1: RES SMD 200 OHM 0.5% 1/8W 0805; Manufacturer: Yageo; Power Rating: 0.125W; Temperature Coefficient: 25 ppm/°C; Voltage Rating: 150V; Resistance: 200Ω; Tolerance: 0.01; Value: 200Ω; Manufacturer Part Number: RT0805DRD07200RL; Automotive: No; Temperature Range High: +155°C; Temperature: -55°C to +155°C; Device Class L3: Chip SMD Resistors; Composition: Thin Film; Lead Free: Yes; Package: RT0805; Temperature Range Low: -55°C; Height: 0.6mm; Category: Res; ComponentLink2URL: http://www.yageo.com/documents/recent/PYu-RT_1-to-0.01_RoHS_L_9.pdf; Device Class L2: Resistors; Series: RT; Footprint Url: http://www.yageo.com/exep/pages/download/literatures/PYu-R_Mount_10.pdf; Digikey Description: RES SMD 200 OHM 0.5% 1/8W 0805; RoHS: TRUE; Octopart: https://octopart.com/rt0805drd07200rl-yageo-1186132; ComponentLink2Description: Datasheet; Device Class L1: Passive Components; Ipc Land Pattern Name: RESC200125X50
R31 R33 = CMP-26527-002555-1: 10Ω ±1% 0.5W 1206 High Power Anti-Sulfur Thin Film Chip Resistor / RNCP1206FTD10R0; Resistance: 10R; Max Power Dissipation: 500mW; Temperature Coefficient: 100ppm/°C; Width: 0.059inch; Lead Free: Lead Free; Packaging: Tape and Reel; Height: 0.024inch; Min Operating Temperature: -55°C; Length: 0.122inch; Mount: Surface Mount; Max Operating Temperature: 155°C; Case Code (Metric): 3216; Case Code (Imperial): 1206; Series: RNCP; RoHS Compliant: Yes; Contact Plating: Tin; Case/Package: 1206; Tolerance: 1%; Features: Moisture Resistant; Number of Terminations: 2; Resistor Type: Thin Film
R32 = RNCP0805FTD1K00: Res Thin Film 0805 1K Ohm 1% 0.25W(1/4W) ±100ppm/C Sulfur Resistant Pad SMD T/R; Manufacturer: Stackpole Electronics; Resistance: 1kR; Power Rating: 250mW; Temperature Coefficient: 100ppm/°C; Supplier 1: Digi-Key; Manufacturer Part Number: RNCP0805FTD1K00; RoHS: Yes; Category: Chip SMD Resistors; Stock 1: 41120; Pricing 1: 1=0.10000, 10=0.07300, 100=0.02970, 1000=0.01336, 2500=0.01159 (USD); Mount: Surface Mount; Case/Package: 0805; Case Code (Metric): 2012; Case Code (Imperial): 0805; Size Code: 0805; Min Operating Temperature: -55°C; Max Operating Temperature: 155°C; Tolerance: 1%; Packaging: Tape and Reel; Resistor Type: Thin Film; Number of Terminations: 2; Max Power Dissipation: 250mW; Features: Moisture Resistant,Anti-Sulfur; Series: RNCP; Length: 0.079inch; Width: 0.049inch; Height: 0.024inch; Lead Free: Lead Free; RoHS Compliant: Yes; ComponentLink1URL: http://www.seielect.com/Catalog/SEI-rncp.pdf?src-supplier=Future+Electronics; ComponentLink1Description: http://www.seielect.com/Catalog/SEI-rncp.pdf?src-supplier=Future+Electronics; ComponentLink2URL: https://www.seielect.com/Catalog/SEI-rncp.pdf?src-supplier=Digi-Key; ComponentLink2Description: https://www.seielect.com/Catalog/SEI-rncp.pdf?src-supplier=Digi-Key; ComponentLink3URL: https://www.seielect.com/catalog/SEI-Packaging.pdf?src-supplier=Digi-Key; ComponentLink3Description: https://www.seielect.com/catalog/SEI-Packaging.pdf?src-supplier=Digi-Key; Supplier Part Number 1: RNCP0805FTD1K00CT-ND
R34 = CMP-2001-04908-2: as R13 on sheet MCU; Weight: 0.000194oz; Package Quantity: 5000; Military Standard: Not; Max Operating Temperature: 155°C; Temperature Coefficient: 100ppm/°C; Contact Plating: Tin; Width: 1.25mm; Height: 0.45mm; Radiation Hardening: No; Tolerance: 1%; Min Operating Temperature: -55°C; Voltage Rating: 150V; Length: 2mm; Depth: 1.25mm; Termination: SMD/SMT; Packaging: Tape and Reel; Case/Package: 0805; Case Code (Metric): 2012; Lead Free: Lead Free; Case Code (Imperial): 0805; Composition: Thick Film
U11 = CMP-0062-00606-4: 1A Low Dropout Regulator, 3-pin TO-263, Pb-Free; Manufacturer: Texas Instruments; PackageTopMarking: NSUZXYTTE#*LM2940CS*-5.0 P+; PowerWise: N; CompType: LDO IC; RoHS: Y; ComponentLink1URL: http://www.ti.com/general/docs/lit/getliterature.tsp?genericPartNumber=LM2940C&fileType=pdf; PinCount: 3; PackageReference: KTT0003B; ComponentLink1Description: Datasheet URL; PackageDescription: TO-263, Molded, .400 x .390 x .180in, 3 Lead, .1in Pitch, Surface Mount; Code_JEDEC: MO-169-AA
U12 = CMP-0339-00059-2: Dual In / Single Out Autoswitching Power Mux, 2.8 to 5.5 V, -40 to 85 degC, 8-pin TSSOP (PW), Green (RoHS & no Sb/Br); Manufacturer: Texas Instruments; SubFamily: Power Multiplexer (MUX); Number of Inputs: 2; IN2 Output Current(Max)(A): 0.75; IN1 rDS(on)(Typ)(mOhm): 120; IN1, IN2 Input Voltage(Max)(V): 5.5; IN2 rDS(on)(Typ)(Ohms): 0.12; IN1, IN2 Input Voltage(Min)(V): 2.8; PackageReference: PW0008A; ComponentLink1URL: http://www.ti.com/general/docs/lit/getliterature.tsp?genericPartNumber=TPS2110A&fileType=pdf; ComponentLink1Description: Datasheet; PackageDescription: 8-Pin Plastic Thin Small Outline Package 3 x 4.4 mm Body ,0.65 mm Pitch; Eco-Plan: Green (RoHS & no Sb/Br); PartNumber: TPS2110APWR; PackageVersion: revG, Feb-2011; Code_JEDEC: MO-153; IN1 Output Current(Max)(A): 0.75; Mounting Technology: Surface Mount; DatasheetVersion: SBVS043A
U13 = IR2302: Manufacture Part Number: IR2302

## Sheet HB_Drive.SchDoc
size 420 x 297 mm; SheetNumber: 2; SheetTotal: 5
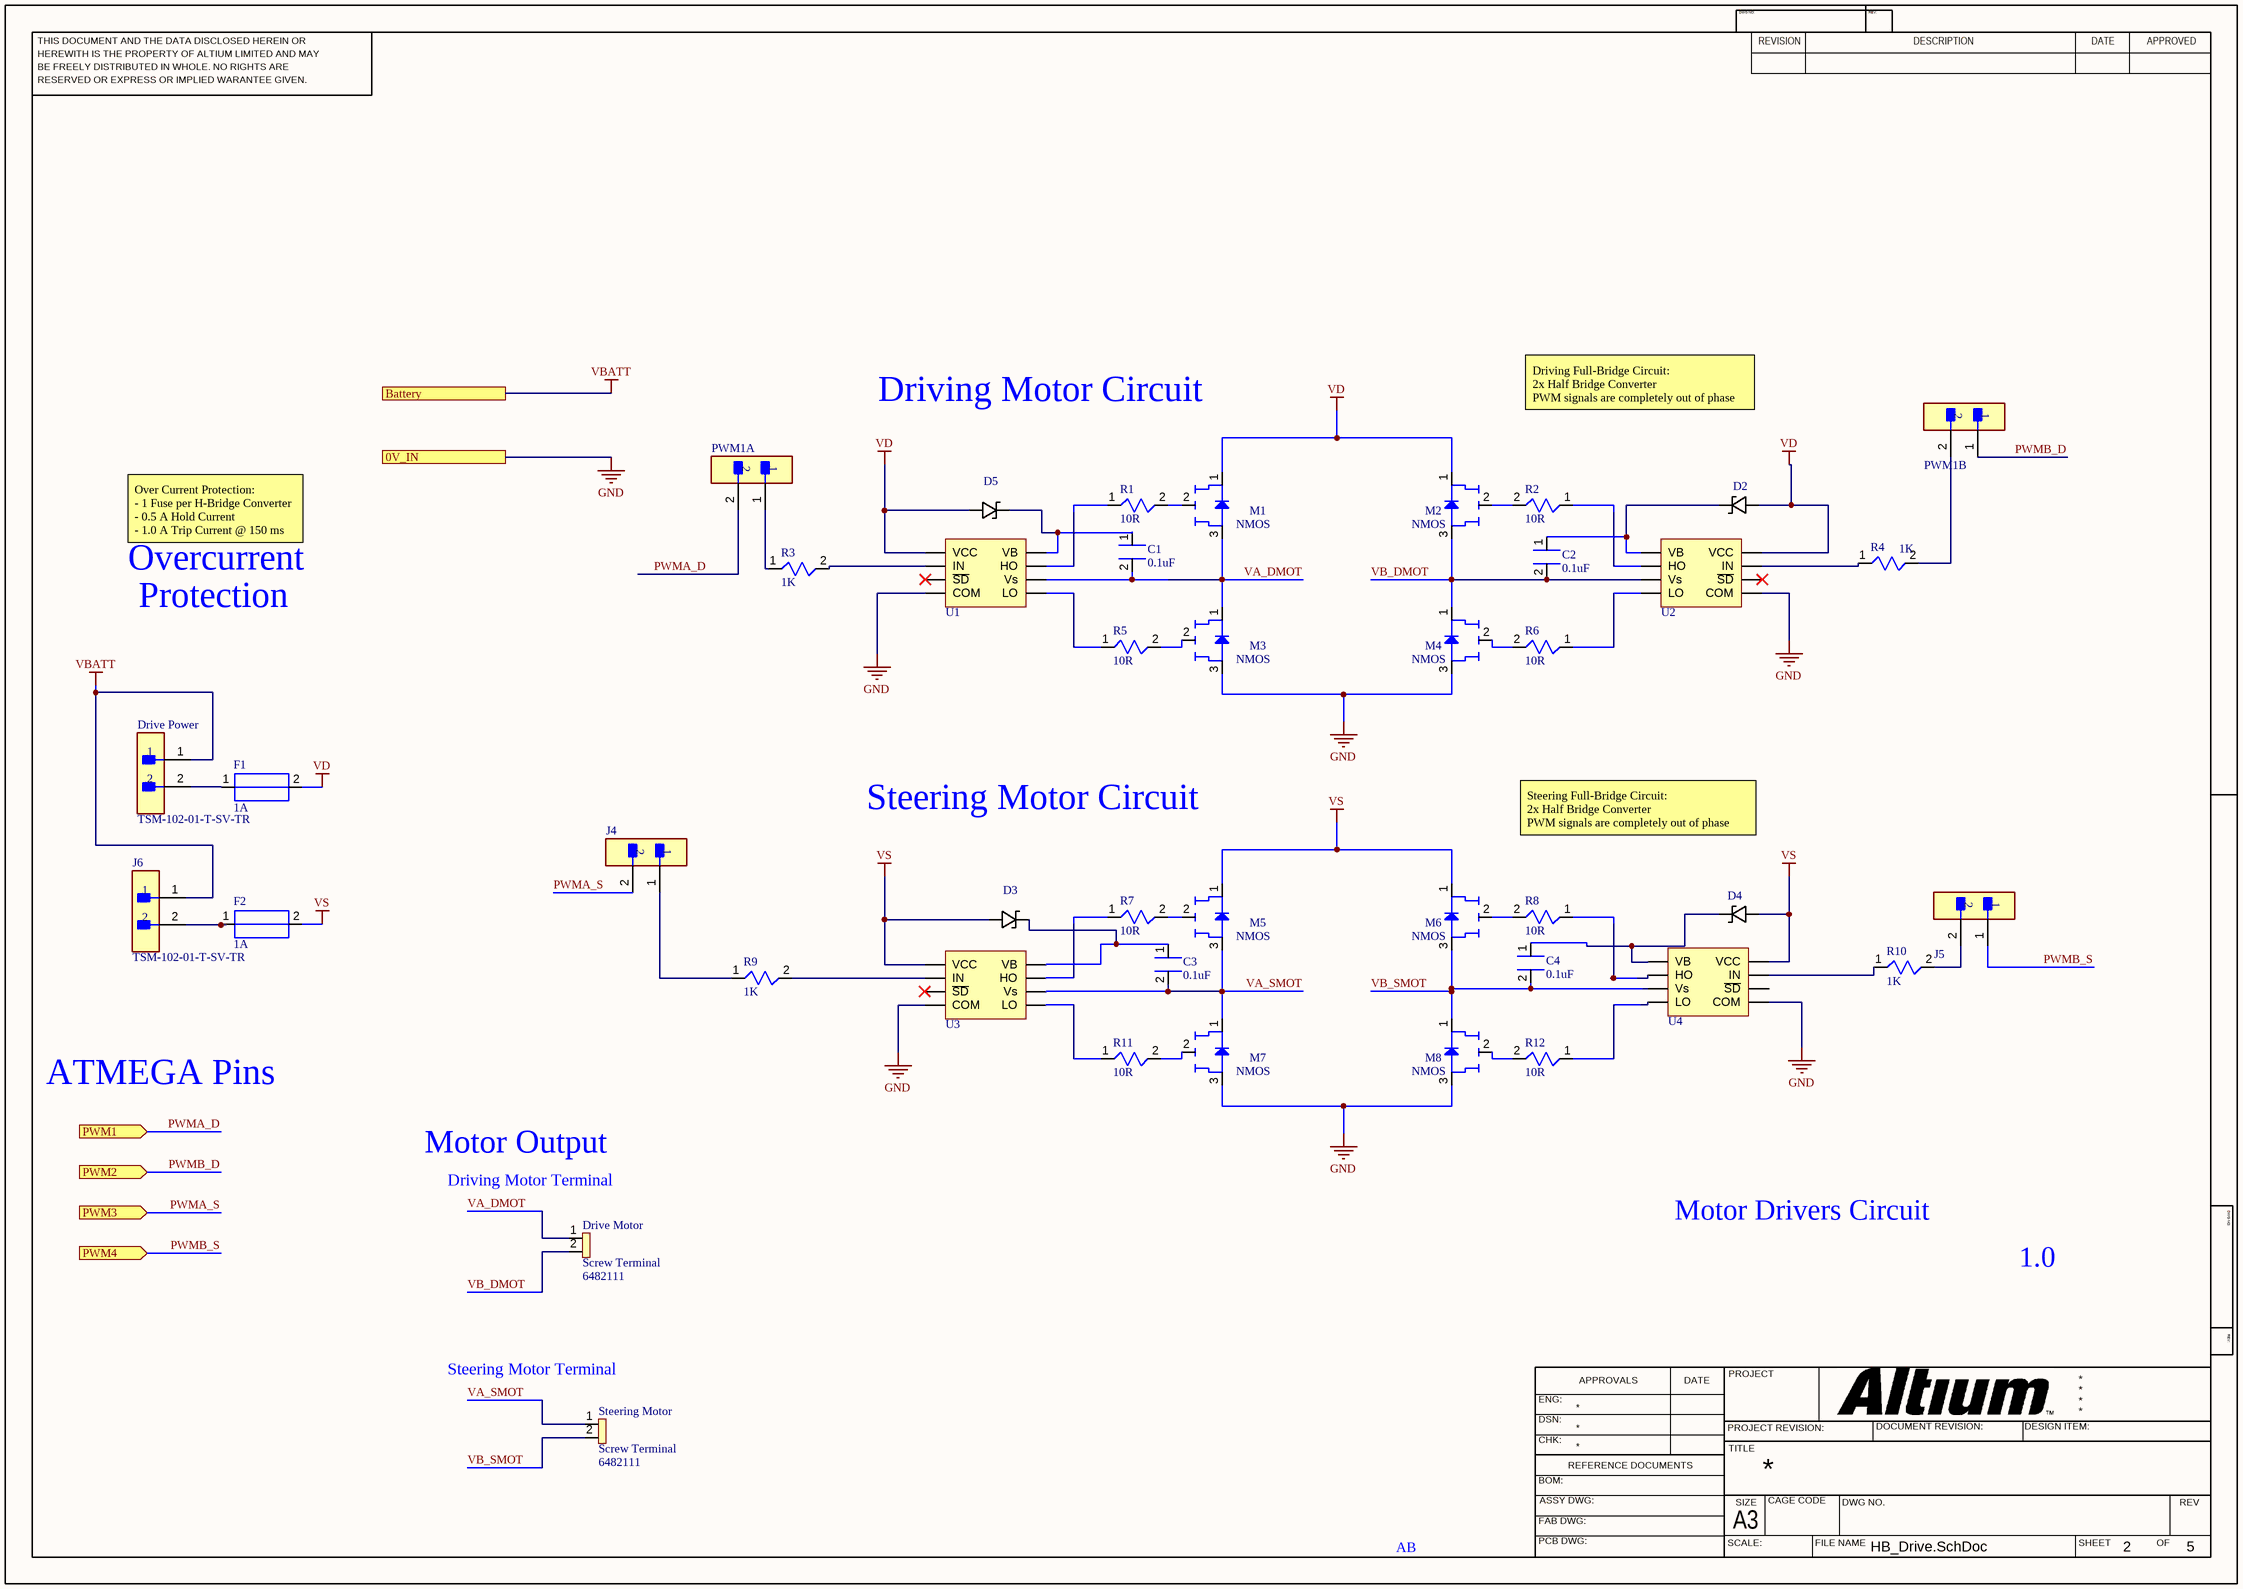
[diagram p4: HB_Drive.SchDoc]

### Parts
C1  0.1uF  [0805B104K500BD]
C2  0.1uF  [0805B104K500BD]
C3  0.1uF  [0805B104K500BD]
C4  0.1uF  [0805B104K500BD]
D2  BAS3005B02VH6327XTSA1  [BAS3005B02VH6327XTSA1]  (value not drawn)
D3  BAS3005B02VH6327XTSA1  [BAS3005B02VH6327XTSA1]  (value not drawn)
D4  BAS3005B02VH6327XTSA1  [BAS3005B02VH6327XTSA1]  (value not drawn)
D5  BAS3005B02VH6327XTSA1  [BAS3005B02VH6327XTSA1]  (value not drawn)
Drive_Motor  Screw Terminal  Supplier Part Number 1: 6482111  [ERM BLOCK 2POS 45DEG 2.5MM PCB]
Drive_Power  TSM-102-01-T-SV-TR  [FP-TSM-102-01-T-SV-TR-MFG]
F1  1A  [0ZCG0050AF2C]
F2  1A  [0ZCG0050AF2C]
J4  TSM-102-01-T-SV-TR  [FP-TSM-102-01-T-SV-TR-MFG]  (value not drawn)
J5  TSM-102-01-T-SV-TR  [FP-TSM-102-01-T-SV-TR-MFG]  (value not drawn)
J6  TSM-102-01-T-SV-TR  [FP-TSM-102-01-T-SV-TR-MFG]
M1  NMOS  [AOD424]
M2  NMOS  [AOD424]
M3  NMOS  [AOD424]
M4  NMOS  [AOD424]
M5  NMOS  [AOD424]
M6  NMOS  [AOD424]
M7  NMOS  [AOD424]
M8  NMOS  [AOD424]
PWM1A  TSM-102-01-T-SV-TR  [FP-TSM-102-01-T-SV-TR-MFG]  (value not drawn)
PWM1B  TSM-102-01-T-SV-TR  [FP-TSM-102-01-T-SV-TR-MFG]  (value not drawn)
R1  10R  [RNCP0805FTD10R0]
R2  10R  [RNCP0805FTD10R0]
R3  1K  [RNCP0805FTD10R0]
R4  1K  [RNCP0805FTD10R0]
R5  10R  [RNCP0805FTD10R0]
R6  10R  [RNCP0805FTD10R0]
R7  10R  [RNCP0805FTD10R0]
R8  10R  [RNCP0805FTD10R0]
R9  1K  [RNCP0805FTD10R0]
R10  1K  [RNCP0805FTD10R0]
R11  10R  [RNCP0805FTD10R0]
R12  10R  [RNCP0805FTD10R0]
Steering_Motor  Screw Terminal  Supplier Part Number 1: 6482111  [ERM BLOCK 2POS 45DEG 2.5MM PCB]
U1  IR2302  [IR2302S]  (value not drawn)
U2  IR2302  [IR2302S]  (value not drawn)
U3  IR2302  [IR2302S]  (value not drawn)
U4  IR2302  [IR2302S]  (value not drawn)

### Ports
0V_IN, Battery, PWM1 (in), PWM2 (in), PWM3 (in), PWM4 (in)

### Nets
GND: M3.3(S) M4.3(S) M7.3(S) M8.3(S) U1.4(COM) U2.4(COM) U3.4(COM) U4.4(COM) ; port 0V_IN
VBATT: Drive_Power.1 J6.1 ; port Battery  [project net BAT_VOLTAGE]
VD: D2.1 D5.1 F1.2(-) M1.1(D) M2.1(D) U1.1(VCC) U2.1(VCC)
VS: D3.1 D4.1 F2.2(-) M5.1(D) M6.1(D) U3.1(VCC) U4.1(VCC)
PWMA_D: PWM1A.2 ; port PWM1  [project net PWM_1A]
PWMA_S: J4.2 ; port PWM3  [project net PWM_2A]
PWMB_D: PWM1B.1 ; port PWM2  [project net CS_PWM1B]
PWMB_S: J5.1 ; port PWM4  [project net PWM_2B]
VA_DMOT: C1.2 Drive_Motor.1 M1.3(S) M3.1(D) U1.6(Vs)
VA_SMOT: C3.2 M5.3(S) M7.1(D) Steering_Motor.1 U3.6(Vs)
VB_DMOT: C2.2 Drive_Motor.2 M2.3(S) M4.1(D) U2.6(Vs)
VB_SMOT: C4.2 M6.3(S) M8.1(D) Steering_Motor.2 U4.6(Vs)
NetC1_1: C1.1(+) D5.2 U1.8(VB)
NetC2_1: C2.1(+) D2.2 U2.8(VB)
NetC3_1: C3.1(+) D3.2 U3.8(VB)
NetC4_1: C4.1(+) D4.2 U4.8(VB)
NetDrive_Power_2: Drive_Power.2 F1.1(+)
NetF2_1: F2.1(+) J6.2
NetJ4_1: J4.1 R9.1(+)
NetJ5_2: J5.2 R10.2(-)
NetM1_2: M1.2(G) R1.2(-)
NetM2_2: M2.2(G) R2.2(-)
NetM3_2: M3.2(G) R5.2(-)
NetM4_2: M4.2(G) R6.2(-)
NetM5_2: M5.2(G) R7.2(-)
NetM6_2: M6.2(G) R8.2(-)
NetM7_2: M7.2(G) R11.2(-)
NetM8_2: M8.2(G) R12.2(-)
NetPWM1A_1: PWM1A.1 R3.1(+)
NetPWM1B_2: PWM1B.2 R4.2(-)
NetR1_1: R1.1(+) U1.7(HO)
NetR2_1: R2.1(+) U2.7(HO)
NetR3_2: R3.2(-) U1.2(IN)
NetR4_1: R4.1(+) U2.2(IN)
NetR5_1: R5.1(+) U1.5(LO)
NetR6_1: R6.1(+) U2.5(LO)
NetR7_1: R7.1(+) U3.7(HO)
NetR8_1: R8.1(+) U4.7(HO)
NetR9_2: R9.2(-) U3.2(IN)
NetR10_1: R10.1(+) U4.2(IN)
NetR11_1: R11.1(+) U3.5(LO)
NetR12_1: R12.1(+) U4.5(LO)

Not connected (* = marked no-connect by the designer): U1 3(~{SD})*; U2 3(~{SD})*; U3 3(~{SD})*; U4 3(~{SD})

### Notes on the sheet
- Driving Motor Circuit
- Driving Full-Bridge Circuit:
  2x Half Bridge Converter
  PWM signals are completely out of phase
- Overcurrent
- Over Current Protection:
  - 1 Fuse per H-Bridge Converter
  - 0.5 A Hold Current
  - 1.0 A Trip Current @ 150 ms
- Protection
- Steering Motor Circuit
- Steering Full-Bridge Circuit:
  2x Half Bridge Converter
  PWM signals are completely out of phase
- ATMEGA Pins
- Motor Output
- (near Drive_Motor) Driving Motor Terminal
- Motor Drivers Circuit
- 1.0
- (near Steering_Motor) Steering Motor Terminal
- AB
- THIS DOCUMENT AND THE DATA DISCLOSED HEREIN OR
- HEREWITH IS THE PROPERTY OF ALTIUM LIMITED AND MAY
- DWG NO:
- REVISION
- REV:
- DESCRIPTION
- DATE
- APPROVED
- BE FREELY DISTRIBUTED IN WHOLE. NO RIGHTS ARE
- RESERVED OR EXPRESS OR IMPLIED WARANTEE GIVEN.
- ENG:
- APPROVALS
- PROJECT
- DSN:
- CHK:
- REFERENCE DOCUMENTS
- PROJECT REVISION:
- TITLE
- DOCUMENT REVISION:
- DESIGN ITEM:
- BOM:
- FAB DWG:
- PCB DWG:
- ASSY DWG:
- SCALE:
- A3
- SIZE
- CAGE CODE
- FILE NAME
- DWG NO.
- SHEET
- OF
- REV

### Library data of the parts
C1-C4 = 0805B104K500BD: 0.1 uF 50V Cap
D2-D5 = BAS3005B02VH6327XTSA1: as D on sheet Buck_Converter
Drive_Motor Steering_Motor = ERM BLOCK 2POS 45DEG 2.5MM PCB: Supplier 1: RSComponents
Drive_Power J4-J6 PWM1A PWM1B = CMP-02766-000113-1: as J7 on sheet MCU; Contact Material: Bronze; Min Operating Temperature: -55°C; REACH SVHC: No SVHC; Housing Material: Polymer; Lead Free: Lead Free; Orientation: Straight; Radiation Hardening: No; Number of Rows: 1; Length: 5.08mm; Housing Color: Black; Max Operating Temperature: 105°C; Contact Plating: Tin; Depth: 2.54mm; Packaging: Tape and Reel; Pitch: 2.54mm; Termination: Solder
F1 F2 = 0ZCG0050AF2C: as F3 on sheet Telemetry_MCU; Supplier 1: Newark; Manufacturer Part Number: 0ZCG0050AF2C; RoHS: Yes; Category: PTC Resettable Fuses; Stock 1: 19101; Pricing 1: 1=0.14000, 10=0.12900, 25=0.12200, 50=0.11500, 100=0.10700, 250=0.09600 (USD); Mount: Surface Mount; Case/Package: 1812; Case Code (Metric): 4532; Case Code (Imperial): 1812; Contact Plating: Tin,Matte; Min Operating Temperature: -40°C; Max Operating Temperature: 85°C; Package Quantity: 1; Packaging: Tape and Reel; Max Current Rating: 100A; Trip Current: 1A; Time to Trip: 0.15s; Lead Free: Lead Free; RoHS Compliant: Yes; ComponentLink1URL: https://datasheet.ciiva.com/18550/0zcg-18550748.pdf?src-supplier=Digi-Key; ComponentLink1Description: https://datasheet.ciiva.com/18550/0zcg-18550748.pdf?src-supplier=Digi-Key; ComponentLink2URL: https://datasheet.ciiva.com/18550/0zcg-18550749.pdf?src-supplier=Digi-Key; ComponentLink2Description: https://datasheet.ciiva.com/18550/0zcg-18550749.pdf?src-supplier=Digi-Key; ComponentLink3URL: https://datasheet.ciiva.com/18550/0zcg-18550750.pdf?src-supplier=Digi-Key; ComponentLink3Description: https://datasheet.ciiva.com/18550/0zcg-18550750.pdf?src-supplier=Digi-Key; Supplier Part Number 1: 48AC8390
M1-M8 = AOD424: as M9 on sheet Buck_Converter; Supplier 1: Digi-Key; Manufacturer Part Number: AOD424; RoHS: Yes; Category: Transistors; Stock 1: 1803; Pricing 1: 1=0.98000, 10=0.86400, 100=0.66240, 500=0.52360, 1000=0.41888 (USD); Mount: Surface Mount; Case/Package: TO-252-3; Min Operating Temperature: -55°C; Max Operating Temperature: 175°C; Packaging: Tape and Reel; Drain to Source Voltage (Vdss): 20V; Series: -; RoHS Compliant: Yes; ComponentLink1URL: https://datasheet.ciiva.com/6384/aod424-6384722.pdf?src-supplier=Digi-Key; ComponentLink1Description: https://datasheet.ciiva.com/6384/aod424-6384722.pdf?src-supplier=Digi-Key; ComponentLink2URL: https://datasheet.ciiva.com/6384/aod424-6384725.pdf?src-supplier=Digi-Key; ComponentLink2Description: https://datasheet.ciiva.com/6384/aod424-6384725.pdf?src-supplier=Digi-Key; Supplier 2: Newark; Number of Pins: 8; Package Quantity: 950; Max Supply Voltage: 20V; Number of Drivers: 2; Turn-On Delay Time: 70ns; Max Supply Current: 1.6mA; Max Output Voltage: 20V; Termination: SMD/SMT; Length: 5mm; Width: 4mm; Height: 1.5mm; Radiation Hardening: No; Lead Free: Lead Free; REACH SVHC: No SVHC; ComponentLink3URL: https://datasheet.ciiva.com/1952/ir2302-1952914.pdf?src-supplier=Digi-Key; ComponentLink3Description: https://datasheet.ciiva.com/1952/ir2302-1952914.pdf?src-supplier=Digi-Key; ComponentLink4URL: https://datasheet.ciiva.com/15110/getdatasheetpartid-188955-15110020.pdf?src-supplier=Verical; ComponentLink4Description: https://datasheet.ciiva.com/15110/getdatasheetpartid-188955-15110020.pdf?src-supplier=Verical; ComponentLink5URL: https://datasheet.ciiva.com/1499/60025-1499718.pdf?src-supplier=Element14; ComponentLink5Description: https://datasheet.ciiva.com/1499/60025-1499718.pdf?src-supplier=Element14; Supplier Part Number 1: 785-1565-1-ND
R1 R2 R5-R8 R11 R12 = RNCP0805FTD10R0: RES 10 OHM 1% 1/4W 0805; Manufacturer: Stackpole Electronics; Max Power Dissipation: 250mW; Temperature Coefficient: 100ppm/°C; Supplier 1: Avnet; Manufacturer Part Number: RNCP0805FTD10R0; RoHS: Yes; Category: Chip SMD Resistors; Stock 1: 65000; Pricing 1: 5000=0.00682, 10000=0.00672, 20000=0.00653, 30000=0.00638, 40000=0.00614, 50000=0.00600, 500000=0.00586 (USD); Mount: Surface Mount; Case/Package: 0805; Case Code (Metric): 2012; Case Code (Imperial): 0805; Min Operating Temperature: -55°C; Max Operating Temperature: 155°C; Resistance: 10R; Tolerance: 1%; Packaging: Tape and Reel; Resistor Type: Thin Film; Number of Terminations: 2; Features: Moisture Resistant,Anti-Sulfur; Series: RNCP; Length: 0.079inch; Width: 0.049inch; Height: 0.024inch; RoHS Compliant: Yes; ComponentLink1URL: https://www.seielect.com/catalog/sei-rncp.pdf?src-supplier=Digi-Key; ComponentLink1Description: https://www.seielect.com/catalog/sei-rncp.pdf?src-supplier=Digi-Key; Supplier Part Number 1: RNCP0805FTD10R0
R3 R4 R9 R10 = RNCP0805FTD1K00: as R32 on sheet Buck_Converter; Supplier 1: Digi-Key; Manufacturer Part Number: RNCP0805FTD1K00; RoHS: Yes; Category: Chip SMD Resistors; Stock 1: 41120; Pricing 1: 1=0.10000, 10=0.07300, 100=0.02970, 1000=0.01336, 2500=0.01159 (USD); Mount: Surface Mount; Case/Package: 0805; Case Code (Metric): 2012; Case Code (Imperial): 0805; Size Code: 0805; Min Operating Temperature: -55°C; Max Operating Temperature: 155°C; Tolerance: 1%; Packaging: Tape and Reel; Resistor Type: Thin Film; Number of Terminations: 2; Max Power Dissipation: 250mW; Features: Moisture Resistant,Anti-Sulfur; Series: RNCP; Length: 0.079inch; Width: 0.049inch; Height: 0.024inch; Lead Free: Lead Free; RoHS Compliant: Yes; ComponentLink1URL: http://www.seielect.com/Catalog/SEI-rncp.pdf?src-supplier=Future+Electronics; ComponentLink1Description: http://www.seielect.com/Catalog/SEI-rncp.pdf?src-supplier=Future+Electronics; ComponentLink2URL: https://www.seielect.com/Catalog/SEI-rncp.pdf?src-supplier=Digi-Key; ComponentLink2Description: https://www.seielect.com/Catalog/SEI-rncp.pdf?src-supplier=Digi-Key; ComponentLink3URL: https://www.seielect.com/catalog/SEI-Packaging.pdf?src-supplier=Digi-Key; ComponentLink3Description: https://www.seielect.com/catalog/SEI-Packaging.pdf?src-supplier=Digi-Key; Supplier Part Number 1: RNCP0805FTD1K00CT-ND
U1-U4 = IR2302: Manufacture Part Number: IR2302